# Altium project MB1137.PrjPCB (part 1 of 2)
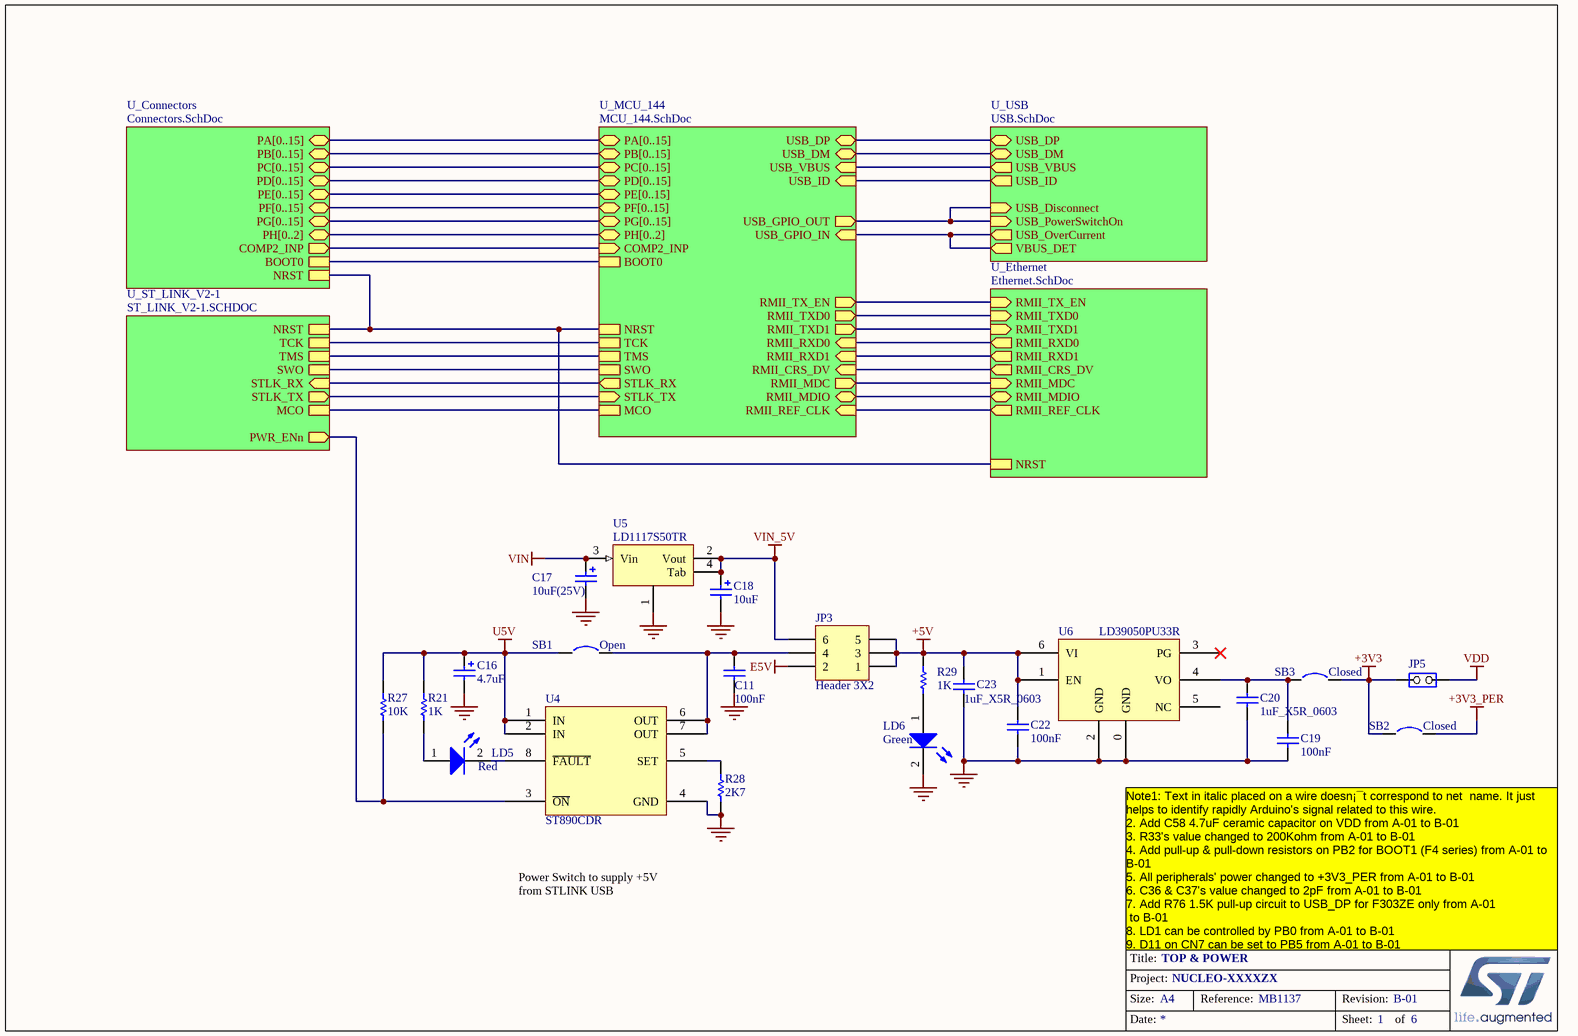
[diagram p0: MB1137.SchDoc]
6 sheets, 293 parts. Net scope: hierarchical (ports join the sheet entries above them; power ports are global).
Board file: MB1137.PcbDoc
Sheets:
  MB1137.SchDoc
    U_Connectors = Connectors.SchDoc
    U_ST_LINK_V2-1 = ST_LINK_V2-1.SCHDOC
    U_Ethernet = Ethernet.SchDoc
    U_MCU_144 = MCU_144.SchDoc
    U_USB = USB.SchDoc

## Sheet MB1137.SchDoc: TOP & POWER
size A4; DocumentNumber: MB1137; Revision: B-01; SheetNumber: 1; SheetTotal: 6; Project: NUCLEO-XXXXZX

### Parts
C11  100nF  [0603C]
C16  4.7uF  [TAN-A]
C17  10uF(25V)  [TAN-B]
C18  10uF  [TAN-A]
C19  100nF  [0603C]
C20  1uF_X5R_0603  [0603C]
C22  100nF  [0603C]
C23  1uF_X5R_0603  [0603C]
JP3  Header 3X2  [HDR_3x2_2R54_V_M]
JP5  (no value)  [HDR_1x2_2R54_V_M_S]
LD5  Red  [0603D-R]
LD6  Green  [0603D-G]
R21  1K  [0603R]
R27  10K  [0603R]
R28  2K7  [0603R]
R29  1K  [0603R]
SB1  Open  [SB_0603]
SB2  Closed  [SB_0603]
SB3  Closed  [SB_0603]
U4  ST890CDR  [SOIC8_1R27_4R9X6]
U5  LD1117S50TR  [SOT-223]
U6  LD39050PU33R  [DFN6_0R95_3x3_TP]

### Sub-sheets
U_Connectors = Connectors.SchDoc: PA[0..15] (bidir), PB[0..15] (bidir), PC[0..15] (bidir), NRST, BOOT0, PD[0..15] (bidir), PE[0..15] (bidir), PF[0..15] (bidir), PG[0..15] (bidir), PH[0..2] (bidir), COMP2_INP (out)
U_Ethernet = Ethernet.SchDoc: RMII_TXD0 (in), RMII_TX_EN (in), RMII_RXD0 (out), RMII_REF_CLK (out), RMII_CRS_DV (out), RMII_MDC (in), RMII_MDIO (bidir), NRST, RMII_TXD1 (in), RMII_RXD1 (out)
U_MCU_144 = MCU_144.SchDoc: NRST, MCO, STLK_TX (in), STLK_RX (out), PA[0..15] (bidir), PB[0..15] (bidir), PC[0..15] (bidir), TCK, TMS, SWO, BOOT0, PD[0..15] (bidir), PE[0..15] (bidir), PF[0..15] (bidir), PG[0..15] (bidir), PH[0..2] (bidir), USB_DM (bidir), USB_DP (bidir), USB_GPIO_OUT (out), USB_GPIO_IN (in), USB_ID (in), USB_VBUS (in), RMII_TXD0 (out), RMII_TX_EN (out), RMII_RXD0 (in), RMII_REF_CLK (in), RMII_CRS_DV (in), RMII_MDC (out), RMII_MDIO (bidir), RMII_TXD1 (out), RMII_RXD1 (in), COMP2_INP (in)
U_ST_LINK_V2-1 = ST_LINK_V2-1.SCHDOC: TMS, TCK, MCO, NRST, STLK_RX (in), STLK_TX (out), SWO, PWR_ENn (out)
U_USB = USB.SchDoc: USB_PowerSwitchOn (in), USB_OverCurrent (out), USB_DM (bidir), USB_DP (bidir), USB_ID (out), USB_VBUS (out), USB_Disconnect (in), VBUS_DET (out)

### Nets
+3V3: JP5.1(COMMON) SB2.1 SB3.2
+3V3_PER: SB2.2
+5V: C22.2 C23.1 JP3.1 JP3.3 JP3.5 R29.2 U6.1(EN) U6.6(VI)
E5V: JP3.2
GND: C11.1 C16.2 C17.2 C18.2 C19.1 C20.2 C22.1 C23.2 LD6.2(K) R28.1 U4.4(GND) U5.1 U6.0(GND) U6.2(GND)
U5V: C16.1 R21.1 R27.1 SB1.1 U4.1(IN) U4.2(IN)
VDD: JP5.2(NO)
VIN: C17.1 U5.3(Vin)
VIN_5V: C18.1 JP3.6 U5.2(Vout) U5.4(Tab)
BOOT0: sheet U_Connectors/BOOT0, sheet U_MCU_144/BOOT0
MCO: sheet U_ST_LINK_V2-1/MCO, sheet U_MCU_144/MCO
NRST: sheet U_Connectors/NRST, sheet U_ST_LINK_V2-1/NRST, sheet U_Ethernet/NRST, sheet U_MCU_144/NRST
PA13: sheet U_ST_LINK_V2-1/TMS, sheet U_MCU_144/TMS
PA14: sheet U_ST_LINK_V2-1/TCK, sheet U_MCU_144/TCK
PB3: sheet U_ST_LINK_V2-1/SWO, sheet U_MCU_144/SWO
PG6: sheet U_MCU_144/USB_GPIO_OUT, sheet U_USB/USB_PowerSwitchOn, sheet U_USB/USB_Disconnect
NetC11_2: C11.2 JP3.4 SB1.2 U4.6(OUT) U4.7(OUT)
NetC19_2: C19.2 C20.1 SB3.1 U6.4(VO)
NetC54_1: sheet U_MCU_144/USB_VBUS, sheet U_USB/USB_VBUS
NetCN5_1: sheet U_ST_LINK_V2-1/STLK_RX, sheet U_MCU_144/STLK_RX
NetCN5_2: sheet U_ST_LINK_V2-1/STLK_TX, sheet U_MCU_144/STLK_TX
NetCN9_15: sheet U_Connectors/COMP2_INP, sheet U_Ethernet/RMII_CRS_DV, sheet U_MCU_144/RMII_CRS_DV, sheet U_MCU_144/COMP2_INP
NetCN13_2: sheet U_MCU_144/USB_DM, sheet U_USB/USB_DM
NetCN13_3: sheet U_MCU_144/USB_DP, sheet U_USB/USB_DP
NetCN13_4: sheet U_MCU_144/USB_ID, sheet U_USB/USB_ID
NetJP4_1: sheet U_MCU_144/USB_GPIO_IN, sheet U_USB/USB_OverCurrent, sheet U_USB/VBUS_DET
NetJP7_1: sheet U_Ethernet/RMII_TXD1, sheet U_MCU_144/RMII_TXD1
NetLD5_1: LD5.1(A) R21.2
NetLD5_2: LD5.2(K) U4.8(~{FAULT})
NetLD6_1: LD6.1(A) R29.1
NetR27_2: R27.2 U4.3(~{ON}) ; sheet U_ST_LINK_V2-1/PWR_ENn
NetR28_2: R28.2 U4.5(SET)
NetR42_2: sheet U_Ethernet/RMII_RXD0, sheet U_MCU_144/RMII_RXD0
NetR45_2: sheet U_Ethernet/RMII_RXD1, sheet U_MCU_144/RMII_RXD1
NetR46_1: sheet U_Ethernet/RMII_MDIO, sheet U_MCU_144/RMII_MDIO
NetR48_2: sheet U_Ethernet/RMII_REF_CLK, sheet U_MCU_144/RMII_REF_CLK
NetSB164_1: sheet U_Ethernet/RMII_MDC, sheet U_MCU_144/RMII_MDC
NetSB182_2: sheet U_Ethernet/RMII_TXD0, sheet U_MCU_144/RMII_TXD0
NetSB183_2: sheet U_Ethernet/RMII_TX_EN, sheet U_MCU_144/RMII_TX_EN

Not connected (* = marked no-connect by the designer): U6 3(PG)* 5(NC)

### Buses and harness runs
bus sheet U_Connectors/PA[0..15] = sheet U_MCU_144/PA[0..15]
bus sheet U_Connectors/PB[0..15] = sheet U_MCU_144/PB[0..15]
bus sheet U_Connectors/PC[0..15] = sheet U_MCU_144/PC[0..15]
bus sheet U_Connectors/PD[0..15] = sheet U_MCU_144/PD[0..15]
bus sheet U_Connectors/PE[0..15] = sheet U_MCU_144/PE[0..15]
bus sheet U_Connectors/PF[0..15] = sheet U_MCU_144/PF[0..15]
bus sheet U_Connectors/PG[0..15] = sheet U_MCU_144/PG[0..15]
bus sheet U_Connectors/PH[0..2] = sheet U_MCU_144/PH[0..2]

### Notes on the sheet
- Power Switch to supply +5V from STLINK USB
- Note1: Text in italic placed on a wire doesn¡¯t correspond to net  name. It just helps to identify rapidly Arduino's signal related to this wire.
  2. Add C58 4.7uF ceramic capacitor on VDD from A-01 to B-01
  3. R33's value changed to 200Kohm from A-01 to B-01
  4. Add pull-up & pull-down resistors on PB2 for BOOT1 (F4 series) from A-01 to B-01
  5. All peripherals' power changed to +3V3_PER from A-01 to B-01
  6. C36 & C37's value changed to 2pF from A-01 to B-01
  7. Add R76 1.5K pull-up circuit to USB_DP for F303ZE only from A-01
  to B-01
  8. LD1 can be controlled by PB0 from A-01 to B-01
  9. D11 on CN7 can be set to PB5 from A-01 to B-01
- Title:
- Project:
- Size:
- Date:
- A4
- Reference:
- Sheet:
- Revision:
- of

### Library data of the parts
C11 C19 C22 = Capacitor_ST: Capacitor 0402 / 0603 / 0805; Revision: July-2002: Re-released for DXP Platform.; Value: 100nF
C16 = Cap Pol1: Polarized Capacitor (Radial); Value: 100pF; Ordered by: Subcon; Published: 8-Jun-2000; Revision: July-2002: Re-released for DXP Platform.; Publisher: Altium Limited
C17 C18 = Cap Pol1: Polarized Capacitor (Radial); Published: 8-Jun-2000; Revision: July-2002: Re-released for DXP Platform.; Publisher: Altium Limited; Value: 10uF
C20 C23 = CAP SMD 0603  X5R 1µF 25V 10%: 0603  X5R 1µF; Rated voltage: 25V; Tolerance: 10%; Manufacturer: *; Manufacturer P/N: *; Order code Farnell: 1288202RL; Value: 1µF; Power: *; Technology: X5R; Temperature  Factor: *; Temperature Max: +125°C; Temperature Min: -55°C; STS Code: *
JP3 = Header 3X2: Header, 3-Pin, Dual row; Revision: 17-Jul-2002: Re-released for DXP Platform.; Publisher: Altium Limited
JP5 = JP2
LD5 LD6 = LED2: Typical RED, GREEN, YELLOW, AMBER GaAs LED; Published: 8-Jun-2000; Revision: July-2002: Re-released for DXP Platform.; Publisher: Altium Limited
R21 = Res1: Resistor; Ordered by: Subcon; Published: 8-Jun-2000; Revision: July-2002: Re-released for DXP Platform.; Publisher: Altium Limited; Value: 1K
R27 = Resistor_ST: Resistor 0402 / 0603 / 0805; Value: 10K
R28 R29 = Resistor_ST: Resistor 0402 / 0603 / 0805; Value: 10K
SB1 = Circuit Breaker: Published: 24-Mar-1999; Revision: July-2002: Re-released for DXP Platform.; Publisher: Altium Limited
SB2 SB3 = Circuit Breaker_close: Circuit Breaker; Published: 24-Mar-1999; Revision: July-2002: Re-released for DXP Platform.; Publisher: Altium Limited
U5 = LD1117
U6 = LD39050P

## Sheet Connectors.SchDoc: Extension connectors
size A3; DocumentNumber: MB1137; Revision: B-01; SheetNumber: 6; SheetTotal: 6; Project: NUCLEO-XXXXZX
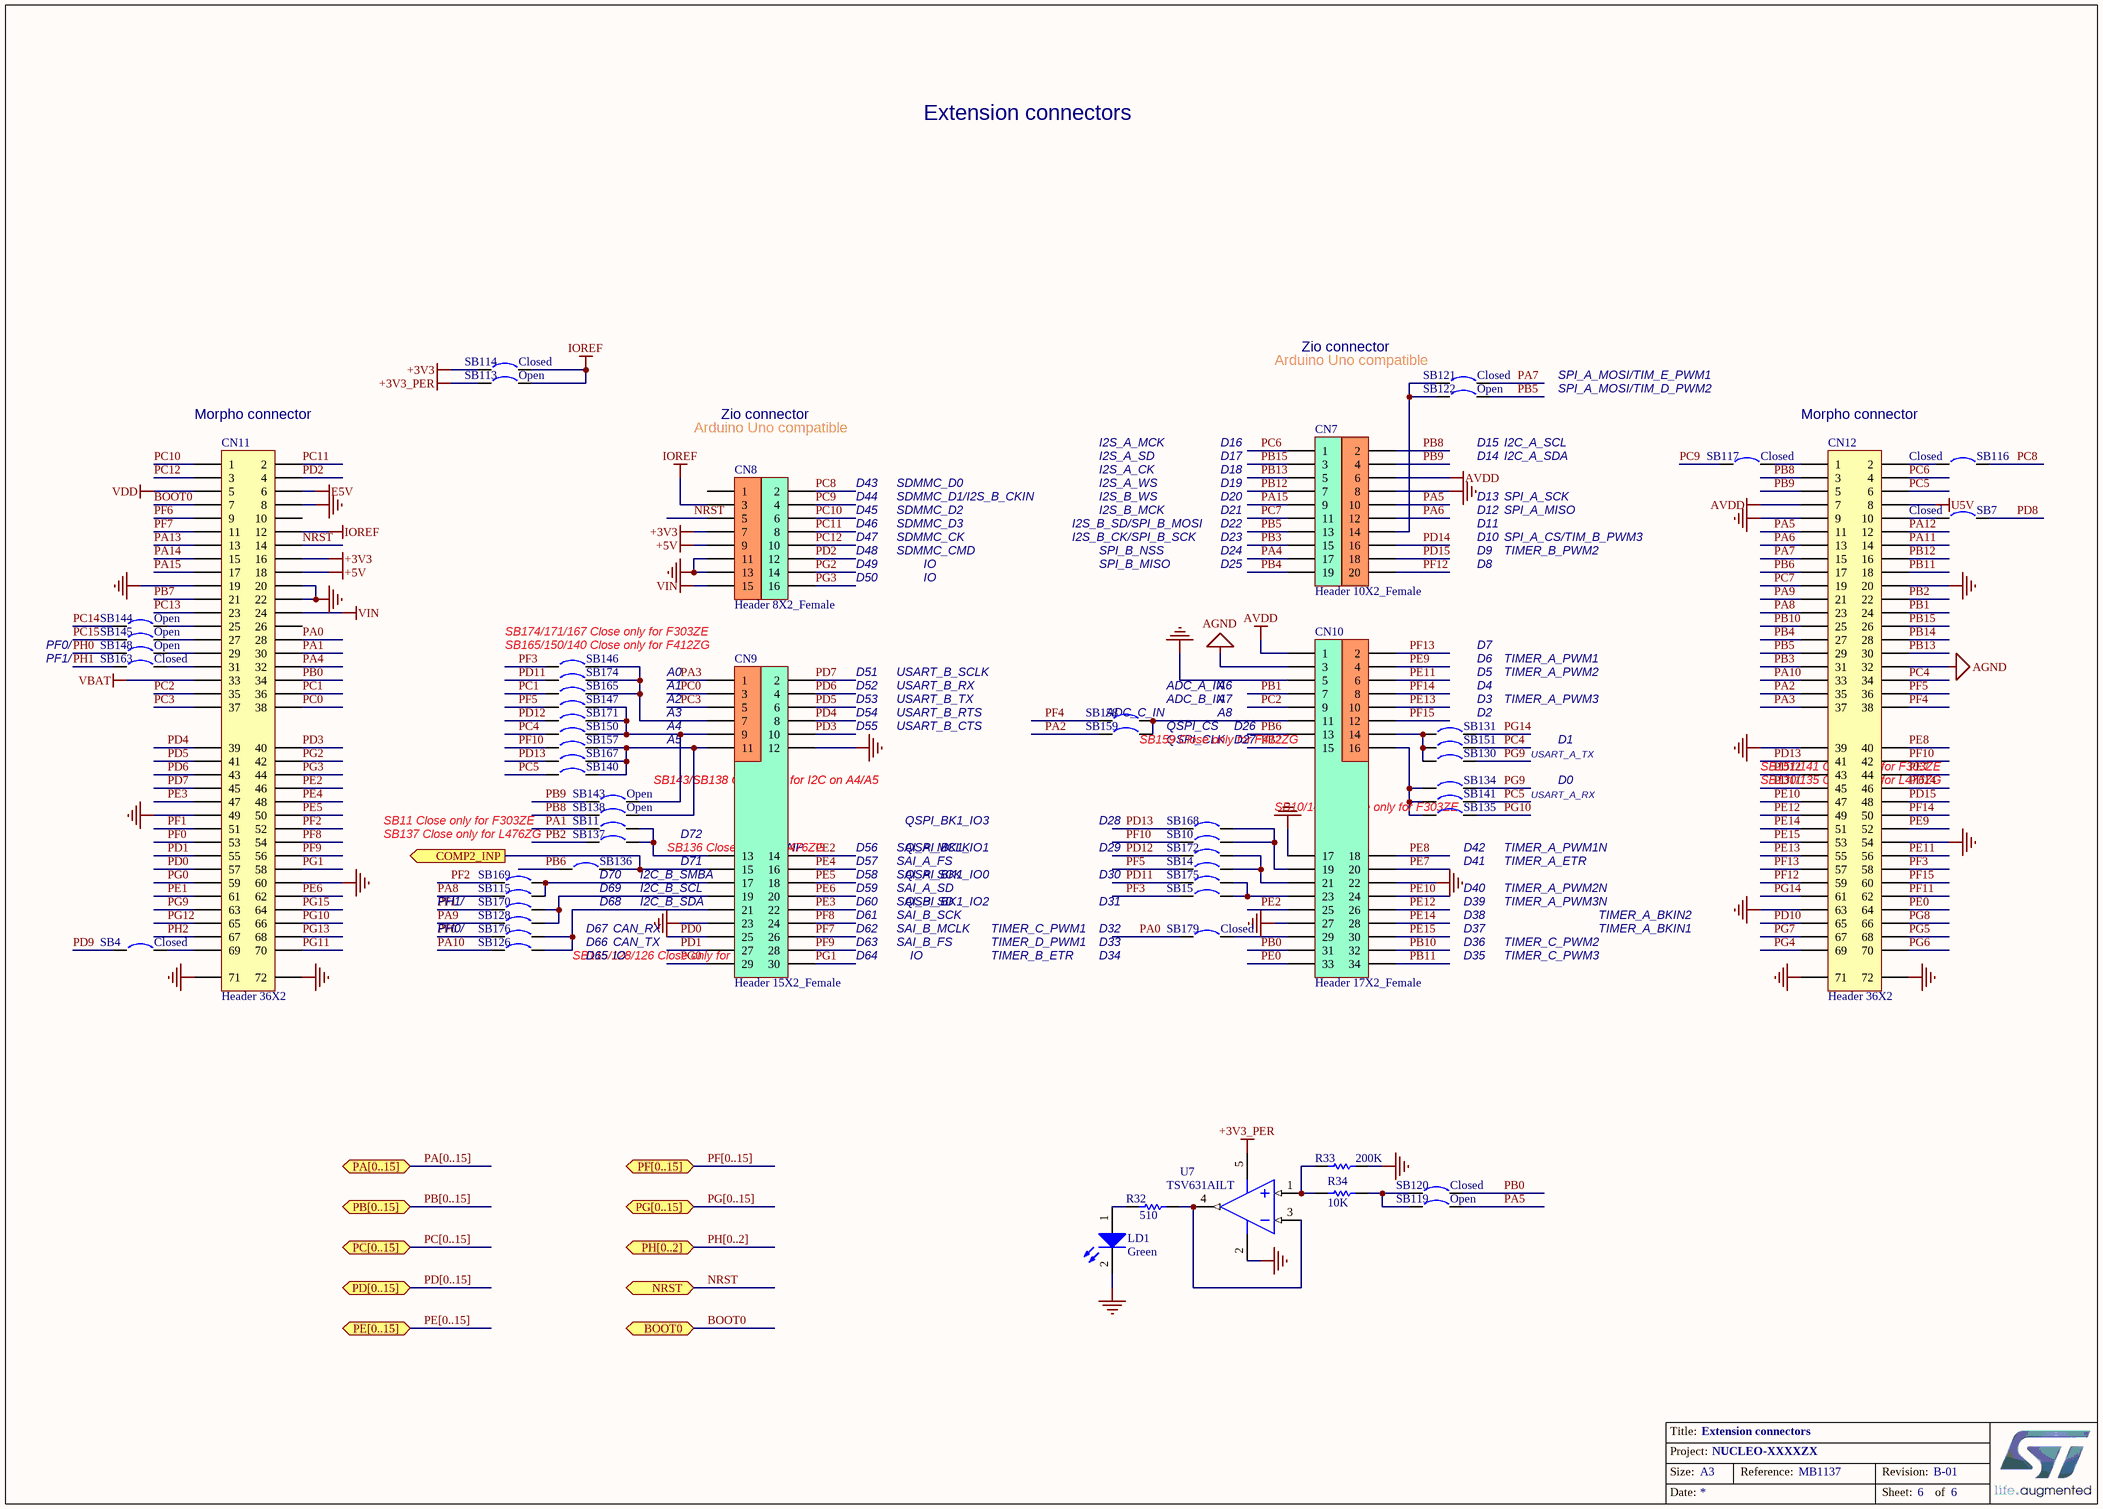
[diagram p1: Connectors.SchDoc]

### Parts
CN7  Header 10X2_Female  [HDR_10x2_2R54_V_F]
CN8  Header 8X2_Female  [HDR_8x2_2R54_V_F]
CN9  Header 15X2_Female  [HDR_15x2_2R54_V_F]
CN10  Header 17X2_Female  [HDR_17x2_2R54_V_F]
CN11  Header 36X2  [HDR_2x36_2R54_V_M]
CN12  Header 36X2  [HDR_2x36_2R54_V_M]
LD1  Green  [0603D-G]
R32  510  [0603R]
R33  200K  [0603R]
R34  10K  [0603R]
SB4  Closed  [SB_0603]
SB7  Closed  [SB_0603]
SB10  Circuit Breaker  [SB_0603]  (value not drawn)
SB11  Circuit Breaker  [SB_0603]  (value not drawn)
SB14  Circuit Breaker  [SB_0603]  (value not drawn)
SB15  Circuit Breaker  [SB_0603]  (value not drawn)
SB113  Open  [SB_0603]
SB114  Closed  [SB_0603]
SB115  Circuit Breaker  [SB_0603]  (value not drawn)
SB116  Closed  [SB_0603]
SB117  Closed  [SB_0603]
SB119  Open  [SB_0603]
SB120  Closed  [SB_0603]
SB121  Closed  [SB_0603]
SB122  Open  [SB_0603]
SB126  Circuit Breaker  [SB_0603]  (value not drawn)
SB128  Circuit Breaker  [SB_0603]  (value not drawn)
SB130  Circuit Breaker  [SB_0603]  (value not drawn)
SB131  Circuit Breaker  [SB_0603]  (value not drawn)
SB134  Circuit Breaker  [SB_0603]  (value not drawn)
SB135  Circuit Breaker  [SB_0603]  (value not drawn)
SB136  Circuit Breaker  [SB_0603]  (value not drawn)
SB137  Circuit Breaker  [SB_0603]  (value not drawn)
SB138  Open  [SB_0603]
SB140  Circuit Breaker  [SB_0603]  (value not drawn)
SB141  Circuit Breaker  [SB_0603]  (value not drawn)
SB143  Open  [SB_0603]
SB144  Open  [SB_0603]
SB145  Open  [SB_0603]
SB146  Circuit Breaker  [SB_0603]  (value not drawn)
SB147  Circuit Breaker  [SB_0603]  (value not drawn)
SB148  Open  [SB_0603]
SB150  Circuit Breaker  [SB_0603]  (value not drawn)
SB151  Circuit Breaker  [SB_0603]  (value not drawn)
SB157  Circuit Breaker  [SB_0603]  (value not drawn)
SB158  Circuit Breaker  [SB_0603]  (value not drawn)
SB159  Circuit Breaker  [SB_0603]  (value not drawn)
SB163  Closed  [SB_0603]
SB165  Circuit Breaker  [SB_0603]  (value not drawn)
SB167  Circuit Breaker  [SB_0603]  (value not drawn)
SB168  Circuit Breaker  [SB_0603]  (value not drawn)
SB169  Circuit Breaker  [SB_0603]  (value not drawn)
SB170  Circuit Breaker  [SB_0603]  (value not drawn)
SB171  Circuit Breaker  [SB_0603]  (value not drawn)
SB172  Circuit Breaker  [SB_0603]  (value not drawn)
SB174  Circuit Breaker  [SB_0603]  (value not drawn)
SB175  Circuit Breaker  [SB_0603]  (value not drawn)
SB176  Circuit Breaker  [SB_0603]  (value not drawn)
SB179  Closed  [SB_0603]
U7  TSV631AILT  [SOT-23-5L]

### Ports
BOOT0, COMP2_INP (out), NRST, PA[0..15] (bidir), PB[0..15] (bidir), PC[0..15] (bidir), PD[0..15] (bidir), PE[0..15] (bidir), PF[0..15] (bidir), PG[0..15] (bidir), PH[0..2] (bidir)

### Nets
+3V3: CN8.7 CN11.16 SB114.1
+3V3_PER: SB113.1 U7.5(VCC)
+5V: CN8.9 CN11.18
AGND: CN10.3 CN12.32
AVDD: CN7.6 CN10.1 CN12.7
E5V: CN11.6
GND: CN7.8 CN8.11 CN8.13 CN9.12 CN9.23 CN10.5 CN10.17 CN10.22 CN10.27 CN11.8 CN11.19 CN11.20 CN11.22 CN11.49 CN11.60 CN11.71 CN11.72 CN12.9 CN12.20 CN12.39 CN12.54 CN12.63 CN12.71 CN12.72 LD1.2(K) R33.2 U7.2(VDD)
IOREF: CN8.3 CN11.12 SB113.2 SB114.2
U5V: CN12.8
VBAT: CN11.33
VDD: CN11.5
VIN: CN8.15 CN11.24
BOOT0: CN11.7 ; port BOOT0
NRST: CN8.5 CN11.14 ; port NRST
PA0: CN11.28 SB179.1
PA1: CN11.30 SB11.2
PA2: CN12.35 SB159.1
PA3: CN9.1 CN12.37
PA4: CN7.17 CN11.32
PA5: CN7.10 CN12.11 SB119.2
PA6: CN7.12 CN12.13
PA7: CN12.15 SB121.2
PA8: CN12.23 SB115.2
PA9: CN12.21 SB128.2
PA10: CN12.33 SB126.2
PA11: CN12.14
PA12: CN12.12
PA13: CN11.13
PA14: CN11.15
PA15: CN7.9 CN11.17
PB0: CN10.31 CN11.34 SB120.1
PB1: CN10.7 CN12.24
PB2: CN10.15 CN12.22 SB137.2
PB3: CN7.15 CN12.31
PB4: CN7.19 CN12.27
PB5: CN7.13 CN12.29 SB122.2
PB6: CN10.13 CN12.17 SB136.2
PB7: CN11.21
PB8: CN7.2 CN12.3 SB138.2
PB9: CN7.4 CN12.5 SB143.2
PB10: CN10.32 CN12.25
PB11: CN10.34 CN12.18
PB12: CN7.7 CN12.16
PB13: CN7.5 CN12.30
PB14: CN12.28
PB15: CN7.3 CN12.26
PC0: CN9.3 CN11.38
PC1: CN11.36 SB165.2
PC2: CN10.9 CN11.35
PC3: CN9.5 CN11.37
PC4: CN12.34 SB150.2 SB151.1
PC5: CN12.6 SB140.2 SB141.1
PC6: CN7.1 CN12.4
PC7: CN7.11 CN12.19
PC8: CN8.2 SB116.1
PC9: CN8.4 SB117.1
PC10: CN8.6 CN11.1
PC11: CN8.8 CN11.2
PC12: CN8.10 CN11.3
PC13: CN11.23
PC14: SB144.1
PC15: SB145.1
PD0: CN9.25 CN11.57
PD1: CN9.27 CN11.55
PD2: CN8.12 CN11.4
PD3: CN9.10 CN11.40
PD4: CN9.8 CN11.39
PD5: CN9.6 CN11.41
PD6: CN9.4 CN11.43
PD7: CN9.2 CN11.45
PD8: SB7.2
PD9: SB4.1
PD10: CN12.65
PD11: CN12.45 SB174.2 SB175.1
PD12: CN12.43 SB171.2 SB172.1
PD13: CN12.41 SB167.2 SB168.1
PD14: CN7.16 CN12.46
PD15: CN7.18 CN12.48
PE0: CN10.33 CN12.64
PE1: CN11.61
PE2: CN9.14 CN10.25 CN11.46
PE3: CN9.22 CN11.47
PE4: CN9.16 CN11.48
PE5: CN9.18 CN11.50
PE6: CN9.20 CN11.62
PE7: CN10.20 CN12.44
PE8: CN10.18 CN12.40
PE9: CN10.4 CN12.52
PE10: CN10.24 CN12.47
PE11: CN10.6 CN12.56
PE12: CN10.26 CN12.49
PE13: CN10.10 CN12.55
PE14: CN10.28 CN12.51
PE15: CN10.30 CN12.53
PF0: CN11.53 SB176.2
PF1: CN11.51 SB170.2
PF2: CN11.52 SB169.2
PF3: CN12.58 SB15.1 SB146.2
PF4: CN12.38 SB158.1
PF5: CN12.36 SB14.1 SB147.2
PF6: CN11.9
PF7: CN9.26 CN11.11
PF8: CN9.24 CN11.54
PF9: CN9.28 CN11.56
PF10: CN12.42 SB10.1 SB157.2
PF11: CN12.62
PF12: CN7.20 CN12.59
PF13: CN10.2 CN12.57
PF14: CN10.8 CN12.50
PF15: CN10.12 CN12.60
PG0: CN9.29 CN11.59
PG1: CN9.30 CN11.58
PG2: CN8.14 CN11.42
PG3: CN8.16 CN11.44
PG4: CN12.69
PG5: CN12.68
PG6: CN12.70
PG7: CN12.67
PG8: CN12.66
PG9: CN11.63 SB130.1 SB134.1
PG10: CN11.66 SB135.1
PG11: CN11.70
PG12: CN11.65
PG13: CN11.68
PG14: CN12.61 SB131.1
PG15: CN11.64
PH0: SB148.1
PH1: SB163.1
PH2: CN11.67
NetCN7_14: CN7.14 SB121.1 SB122.1
NetCN9_7: CN9.7 SB146.1 SB165.1 SB174.1
NetCN9_9: CN9.9 SB143.1 SB147.1 SB150.1 SB171.1
NetCN9_11: CN9.11 SB138.1 SB140.1 SB157.1 SB167.1
NetCN9_13: CN9.13 SB11.1 SB137.1
NetCN9_15: CN9.15 SB136.1 ; port COMP2_INP
NetCN9_17: CN9.17 SB115.1 SB169.1
NetCN9_19: CN9.19 SB128.1 SB170.1
NetCN9_21: CN9.21 SB126.1 SB176.1
NetCN10_11: CN10.11 SB158.2 SB159.2
NetCN10_14: CN10.14 SB130.2 SB131.2 SB151.2
NetCN10_16: CN10.16 SB134.2 SB135.2 SB141.2
NetCN10_19: CN10.19 SB10.2 SB168.2
NetCN10_21: CN10.21 SB14.2 SB172.2
NetCN10_23: CN10.23 SB15.2 SB175.2
NetCN10_29: CN10.29 SB179.2
NetCN11_25: CN11.25 SB144.2
NetCN11_27: CN11.27 SB145.2
NetCN11_29: CN11.29 SB148.2
NetCN11_31: CN11.31 SB163.2
NetCN11_69: CN11.69 SB4.2
NetCN12_1: CN12.1 SB117.2
NetCN12_2: CN12.2 SB116.2
NetCN12_10: CN12.10 SB7.1
NetLD1_1: LD1.1(A) R32.2
NetR32_1: R32.1 U7.3(IN-) U7.4(OUT)
NetR33_1: R33.1 R34.1 U7.1(IN+)
NetR34_2: R34.2 SB119.1 SB120.2

Not connected (* = marked no-connect by the designer): CN8 1; CN11 10 26

### Buses and harness runs
bus PA[0..15] = port PA[0..15]
bus PB[0..15] = port PB[0..15]
bus PC[0..15] = port PC[0..15]
bus PD[0..15] = port PD[0..15]
bus PE[0..15] = port PE[0..15]
bus PF[0..15] = port PF[0..15]
bus PG[0..15] = port PG[0..15]
bus PH[0..2] = port PH[0..2]

### Notes on the sheet
- Extension connectors
- Arduino Uno compatible
- Zio connector
- SPI_A_MOSI/TIM_E_PWM1
- (near CN11) Morpho connector
- I2S_A_MCK
- D16
- D15
- I2C_A_SCL
- SPI_A_MOSI/TIM_D_PWM2
- Morpho connector
- D43
- D44
- D45
- SDMMC_D0
- SDMMC_D1/I2S_B_CKIN
- SDMMC_D2
- I2S_A_SD
- I2S_A_CK
- I2S_A_WS
- I2S_B_WS
- I2S_B_MCK
- D17
- D18
- D19
- D20
- D21
- D14
- D13
- D12
- SPI_A_SCK
- SPI_A_MISO
- I2C_A_SDA
- D46
- D47
- D48
- D49
- D50
- SDMMC_CK
- SDMMC_CMD
- SDMMC_D3
- IO
- I2S_B_SD/SPI_B_MOSI
- I2S_B_CK/SPI_B_SCK
- SPI_B_MISO
- SPI_B_NSS
- D22
- D23
- D24
- D25
- D8
- D9
- D10
- D11
- TIMER_B_PWM2
- SPI_A_CS/TIM_B_PWM3
- PF0/
- SB174/171/167 Close only for F303ZE
- (near SB146) SB165/150/140 Close only for F412ZG
- D7
- PF1/
- A0
- A1
- A2
- A3
- D51
- D52
- D53
- D54
- USART_B_TX
- USART_B_RX
- USART_B_SCLK
- USART_B_RTS
- ADC_A_IN
- ADC_B_IN
- ADC_C_IN
- A6
- A7
- A8
- (near SB131) D2
- D4
- D3
- D5
- D6
- TIMER_A_PWM1
- TIMER_A_PWM2
- TIMER_A_PWM3
- (near SB140) SB143/SB138 Close only for I2C on A4/A5
- A4
- A5
- D55
- USART_B_CTS
- (near SB159) SB159 Close only for F412ZG
- QSPI_CLK
- QSPI_CS
- D26
- D27
- USART_A_TX
- D0
- D1
- SB151/141 Close only for F303ZE
- SB130/135 Close only for L476ZG
- (near CN11) /PH1
- (near CN11) /PH0
- SB11 Close only for F303ZE
- SB137 Close only for L476ZG
- (near SB137) SB136 Close only for L476ZG
- D72
- (near CN9) COMP1_INP
- D56
- SAI_A_MCLK
- QSPI_BK1_IO1
- QSPI_BK1_IO3
- D28
- D29
- (near SB168) SB10/14/15 Close only for F303ZE
- D42
- TIMER_A_PWM1N
- USART_A_RX
- PH1/
- (near SB136) D70
- (near SB136) D69
- (near SB136) D68
- I2C_B_SCL
- I2C_B_SDA
- I2C_B_SMBA
- D71
- D57
- D58
- D59
- D60
- D61
- SAI_A_SD
- SAI_A_SCK
- SAI_A_FS
- SAI_B_SD
- SAI_B_SCK
- QSPI_BK1_IO0
- QSPI_BK1_IO2
- D30
- D31
- D38
- D39
- D40
- D41
- TIMER_A_PWM2N
- TIMER_A_PWM3N
- TIMER_A_ETR
- TIMER_A_BKIN2
- PH0/
- (near SB126) SB115/128/126 Close only for F303ZE
- D67
- D66
- D65
- CAN_TX
- CAN_RX
- D62
- D63
- D64
- SAI_B_FS
- SAI_B_MCLK
- TIMER_D_PWM1
- TIMER_B_ETR
- TIMER_C_PWM1
- D32
- D33
- D34
- D35
- D36
- D37
- TIMER_C_PWM2
- TIMER_C_PWM3
- TIMER_A_BKIN1
- Title:
- Project:
- Size:
- Date:
- Reference:
- Sheet:
- Revision:
- of

### Library data of the parts
CN7 = Header 10X2_Female: Header, 10-Pin, Dual row,female; LatestRevisionDate: 17-Jul-2002; LatestRevisionNote: Re-released for DXP Platform.; Publisher: Altium Limited
CN8 = Header 8X2_Female: Header, 8-Pin, Dual row,female; LatestRevisionDate: 17-Jul-2002; LatestRevisionNote: Re-released for DXP Platform.; Publisher: Altium Limited
CN9 = Header 15X2_Female: Header, 15-Pin, Dual row,female; Revision: 17-Jul-2002: Re-released for DXP Platform.; Publisher: Altium Limited
CN10 = Header 17X2_Female: Header, 17-Pin, Dual row,female; Revision: 17-Jul-2002: Re-released for DXP Platform.; Publisher: Altium Limited
CN11 CN12 = Header 36X2: Header, 36-Pin, Dual row; Revision: 17-Jul-2002: Re-released for DXP Platform.; Publisher: Altium Limited
LD1 = LED2: as LD5 on sheet MB1137; Published: 8-Jun-2000; Revision: July-2002: Re-released for DXP Platform.; Publisher: Altium Limited
R32 = Res1: Resistor; Value: 1K; Published: 8-Jun-2000; Revision: July-2002: Re-released for DXP Platform.; Publisher: Altium Limited
R33 R34 = res1: Resistor; Value: 1K; Published: 8-Jun-2000; Revision: July-2002: Re-released for DXP Platform.; Publisher: Altium Limited
SB4 SB7 SB114 SB116 SB117 SB120 SB121 SB163 SB179 = Circuit Breaker_close: Circuit Breaker; Published: 24-Mar-1999; Revision: July-2002: Re-released for DXP Platform.; Publisher: Altium Limited
SB10 SB11 SB14 SB15 SB115 SB126 SB128 SB130 SB131 SB134-SB137 SB140 SB141 SB146 SB147 SB150 SB151 SB157-SB159 SB165 SB167-SB172 SB174-SB176 = Circuit Breaker: Solder: NO; Published: 24-Mar-1999; Revision: July-2002: Re-released for DXP Platform.; Publisher: Altium Limited
SB113 SB119 SB122 SB138 SB143-SB145 SB148 = Circuit Breaker: Published: 24-Mar-1999; Revision: July-2002: Re-released for DXP Platform.; Publisher: Altium Limited

## Sheet ST_LINK_V2-1.SCHDOC: STLINK/V2-1
size A4; DocumentNumber: MB1137; Revision: B-01; SheetNumber: 3; SheetTotal: 6; Project: NUCLEO-XXXXZX
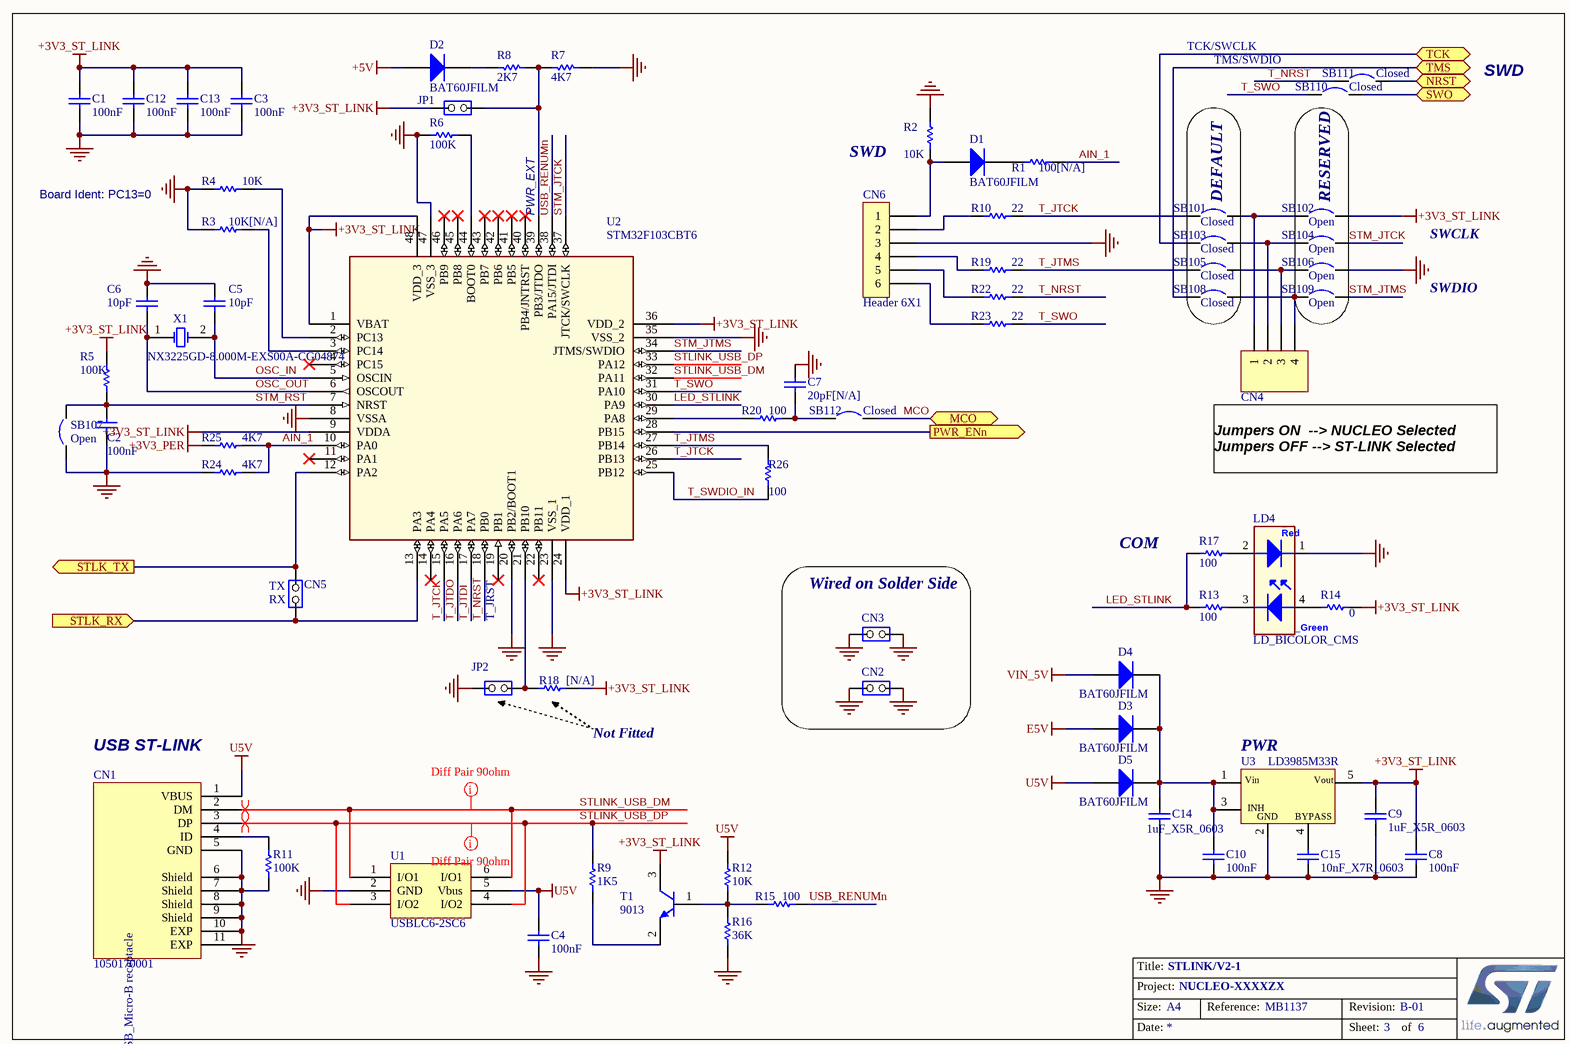
[diagram p2: ST_LINK_V2-1.SCHDOC]

### Parts
C1  100nF  [0603C]
C2  100nF  [0603C]
C3  100nF  [0603C]
C4  100nF  [0603C]
C5  10pF  [0603C]
C6  10pF  [0603C]
C7  20pF[N/A]  [0603C]
C8  100nF  [0603C]
C9  1uF_X5R_0603  [0603C]
C10  100nF  [0603C]
C12  100nF  [0603C]
C13  100nF  [0603C]
C14  1uF_X5R_0603  [0603C]
C15  10nF_X7R_0603  [0603C]
CN1  1050170001  [Molex_1050170001]
CN2  (no value)  [HDR_1x2_2R54_V_M]
CN3  (no value)  [HDR_1x2_2R54_V_M]
CN4  Header 4  [HDR_1x4_2R54_V_M]  (value not drawn)
CN5  (no value)  [HDR_1x2_2R54_V_M_S]
CN6  Header 6X1  [HDR_1x6_2R54_V_M]
D1  BAT60JFILM  [SOD-323]
D2  BAT60JFILM  [SOD-323]
D3  BAT60JFILM  [SOD-323]
D4  BAT60JFILM  [SOD-323]
D5  BAT60JFILM  [SOD-323]
JP1  (no value)  [HDR_1x2_2R54_V_M_S]
JP2  (no value)  [HDR_1x2_2R54_V_M_S]
LD4  LD_BICOLOR_CMS  [HSMF-A201]
R1  100[N/A]  [0603R]
R2  10K  [0603R]
R3  10K[N/A]  [0603R]
R4  10K  [0603R]
R5  100K  [0603R]
R6  100K  [0603R]
R7  4K7  [0603R]
R8  2K7  [0603R]
R9  1K5  [0603R]
R10  22  [0603R]
R11  100K  [0603R]
R12  10K  [0603R]
R13  100  [0603R]
R14  0  [0603R]
R15  100  [0603R]
R16  36K  [0603R]
R17  100  [0603R]
R18  [N/A]  [0603R]
R19  22  [0603R]
R20  100  [0603R]
R22  22  [0603R]
R23  22  [0603R]
R24  4K7  [0603R]
R25  4K7  [0603R]
R26  100  [0603R]
SB101  Closed  [SB_0603]
SB102  Open  [SB_0603]
SB103  Closed  [SB_0603]
SB104  Open  [SB_0603]
SB105  Closed  [SB_0603]
SB106  Open  [SB_0603]
SB107  Open  [SB_0603]
SB108  Closed  [SB_0603]
SB109  Open  [SB_0603]
SB110  Closed  [SB_0603]
SB111  Closed  [SB_0603]
SB112  Closed  [SB_0603]
T1  9013  [SOT-23]
U1  USBLC6-2SC6  [SOT23-6L]
U2  STM32F103CBT6  [LQFP48_0R5_7x7]
U3  LD3985M33R  [SOT-23-5L]
X1  NX3225GD-8.000M-EXS00A-CG04874  [OSC_2SM_3R2x2R5]

### Blocks framed on the sheet
DEFAULT: SB101 SB103 SB105 SB108
RESERVED: SB102 SB104 SB106 SB109
Wired on Solder Side: CN2 CN3

### Ports
MCO, NRST, PWR_ENn (out), STLK_RX (in), STLK_TX (out), SWO, TCK, TMS

### Nets
+3V3_PER: R25.1
+3V3_ST_LINK: C1.2 C3.2 C8.2 C9.1 C12.2 C13.2 JP1.1(COMMON) R5.2 R14.2 R18.1 SB102.2 T1.3(C) U2.1(VBAT) U2.9(VDDA) U2.24(VDD_1) U2.36(VDD_2) U2.48(VDD_3) U3.5(Vout)
+5V: D2.1(A)
E5V: D3.1(A)
GND: C1.1 C2.1 C3.1 C4.1 C5.2 C6.2 C7.2 C8.1 C9.2 C10.1 C12.1 C13.1 C14.1 C15.1 CN1.5(GND) CN1.6(Shield) CN1.7(Shield) CN1.8(Shield) CN1.9(Shield) CN1.10(EXP) CN2.1(COMMON) CN2.2(NO) CN3.1(COMMON) CN3.2(NO) CN6.3 JP2.1(COMMON) LD4.1 R2.2 R3.1 R4.1 R6.1 R7.2 R11.2 R16.1 R24.1 SB106.2 SB107.1 U1.2(GND) U2.8(VSSA) U2.20(PB2/BOOT1) U2.23(VSS_1) U2.35(VSS_2) U2.47(VSS_3) U3.2(GND)
U5V: C4.2 CN1.1(VBUS) D5.1(A) R12.2 U1.5(Vbus)
VIN_5V: D4.1(A)
AIN_1: R1.2 R24.2 R25.2 U2.10(PA0)
LED_STLINK: R13.1 R17.1 U2.30(PA9)
MCO: SB112.2 ; port MCO
NRST: SB111.2 ; port NRST
OSC_IN: C5.1 U2.5(OSCIN) X1.2(OSC2)
OSC_OUT: C6.1 U2.6(OSCOUT) X1.1(OSC1)
PA13: SB108.1 ; port TMS
PA14: SB103.1 ; port TCK
PB3: SB110.2 ; port SWO
STLINK_USB_DM: CN1.2(DM) U1.1(I/O1) U1.6(I/O1) U2.32(PA11)
STLINK_USB_DP: CN1.3(DP) R9.1 U1.3(I/O2) U1.4(I/O2) U2.33(PA12)
STM_JTCK: SB104.2 U2.37(JTCK/SWCLK)
STM_JTMS: SB109.2 U2.34(JTMS/SWDIO)
STM_RST: C2.2 R5.1 SB107.2 U2.7(NRST)
T_JTCK: R10.2 SB101.1 U2.15(PA5) U2.26(PB13)
T_JTDI: U2.17(PA7)
T_JTDO: U2.16(PA6)
T_JTMS: R19.2 R26.2 SB105.1 U2.27(PB14)
T_NRST: R22.2 SB111.1 U2.18(PB0)
T_SWDIO_IN: R26.1 U2.25(PB12)
T_SWO: R23.2 SB110.1 U2.31(PA10)
USB_RENUMn: R15.2 U2.38(PA15/JTDI)
NetC7_1: C7.1 R20.2 SB112.1
NetC10_2: C10.2 C14.2 D3.2(K) D4.2(K) D5.2(K) U3.1(Vin) U3.3(CE)
NetC15_2: C15.2 U3.4(BYPASS)
NetCN1_4: CN1.4(ID) R11.1
NetCN4_1: CN4.1 SB101.2 SB102.1
NetCN4_2: CN4.2 SB103.2 SB104.1
NetCN4_3: CN4.3 SB105.2 SB106.1
NetCN4_4: CN4.4 SB108.2 SB109.1
NetCN5_1: CN5.1(COMMON) U2.13(PA3) ; port STLK_RX
NetCN5_2: CN5.2(NO) U2.12(PA2) ; port STLK_TX
NetCN6_1: CN6.1 D1.1(A) R2.1
NetCN6_2: CN6.2 R10.1
NetCN6_4: CN6.4 R19.1
NetCN6_5: CN6.5 R22.1
NetCN6_6: CN6.6 R23.1
NetD1_2: D1.2(K) R1.1
NetD2_2: D2.2(K) R8.1
NetJP1_2: JP1.2(NO) R7.1 R8.2 U2.39(PB3/JTDO)
NetJP2_2: JP2.2(NO) R18.2 U2.21(PB10)
NetLD4_2: LD4.2 R17.2
NetLD4_3: LD4.3 R13.2
NetLD4_4: LD4.4 R14.1
NetR3_2: R3.2 U2.3(PC14)
NetR4_2: R4.2 U2.2(PC13)
NetR6_2: R6.2 U2.44(BOOT0)
NetR9_2: R9.2 T1.2(E)
NetR12_1: R12.1 R15.1 R16.2 T1.1(B)
NetR20_1: R20.1 U2.29(PA8)
NetR27_2: U2.28(PB15) ; port PWR_ENn

Not connected (* = marked no-connect by the designer): CN1 11(EXP); U2 4(PC15)* 11(PA1)* 14(PA4)* 19(PB1)* 22(PB11)* 40(PB4/JNTRST)* 41(PB5)* 42(PB6)* 43(PB7)* 45(PB8)* 46(PB9)*

### Layout directives
differential pair: (no net found under the mark)
mark named Diff Pair 90ohm: STLINK_USB_DM, STLINK_USB_DP

### Notes on the sheet
- TCK/SWCLK
- TMS/SWDIO
- SWD
- Board Ident: PC13=0
- (near U2) PWR_EXT
- SWCLK
- SWDIO
- Jumpers ON  --> NUCLEO Selected
  Jumpers OFF --> ST-LINK Selected
- (near CN5) TX
- COM
- (near CN5) RX
- T_JRST
- (near CN1) USB ST-LINK
- (near R18) Not Fitted
- (near U3) PWR
- Title:
- Project:
- Size:
- Date:
- A4
- Reference:
- Sheet:
- Revision:
- of
- (in symbol 1050170001) USB_Micro-B receptacle
- (in symbol LD3985M33R) INH
- (in symbol LD_BICOLOR_CMS) Red; _Green

### Library data of the parts
C1-C4 C8 C10 C12 C13 = Capacitor_ST: Capacitor 0402 / 0603 / 0805; Revision: July-2002: Re-released for DXP Platform.; Value: 100nF
C5-C7 = Capacitor_ST: Capacitor 0402 / 0603 / 0805; Value: 100nF; Revision: July-2002: Re-released for DXP Platform.
C9 C14 = CAP SMD 0603  X5R 1µF 25V 10%: as C20 on sheet MB1137; Manufacturer: *; Manufacturer P/N: *; Order code Farnell: 1288202RL; Value: 1µF; Power: *; Technology: X5R; Temperature  Factor: *; Temperature Max: +125°C; Temperature Min: -55°C; STS Code: *
C15 = CAP SMD 0603  X7R 10000PF 50V 10%: 0603  X7R 10NF; Order code RS: 2040779; Rated voltage: 50V; Tolerance: 10%; Order code Farnell: 7569548RL; Value: 10NF; Power: *; Technology: X7R; Temperature Factor: *; Temperature Min: -55°C; Temperature Max: +125°C; STS Code: *
CN1 = 1050170001: Silkscreen: USB
CN2 CN3 JP1 JP2 = JP2
CN4 = Header 4: Header, 4-Pin, Single row; Revision: 17-Jul-2002: Re-released for DXP Platform.; Publisher: Altium Limited
CN5 = JP2: Fitted: NO
CN6 = Header 6X1: Header, 6-Pin, Single row; LatestRevisionDate: 17-Jul-2002; LatestRevisionNote: Re-released for DXP Platform.; Publisher: Altium Limited
D1 D3-D5 = BAT60JFILM: Manuf_1: STM; Provided: ST; ECCN_US/EU: EAR99/NEC; Revision: July-2002: Re-released for DXP Platform.; Order: BAT60JFILM; Manuf_Part_1: BAT60JFILM; Distrib: ST
D2 = Diode: Default Diode; Code - JEDEC: DO-214-AB; Ordered by: STM; ECCN_US/EU: EAR99/NEC; Published: 8-Jun-2000; Revision: July-2002: Re-released for DXP Platform.; Publisher: Altium Limited
LD4 = LD_BICOLOR_CMS: Bicolor Led; Manuf_Part_1: HSMF-A201-A00J1; Manuf_1: Avago Technologies; Ref St: xxxxxx; cap_dec: ----; Distrib: RADIOSPARES
R1 R5 R6 R9-R11 R13-R15 R17 R19 R20 R22 R23 R26 = Resistor_ST: Resistor 0402 / 0603 / 0805; Value: 10K
R2 R4 = Resistor_ST: Resistor 0402 / 0603 / 0805; Value: 10K
R3 R24 R25 = Resistor_ST: Resistor 0402 / 0603 / 0805; Value: 10K; Fitted: NO
R7 R8 R12 R16 R18 = Res1: Resistor; Value: 1K; Published: 8-Jun-2000; Revision: July-2002: Re-released for DXP Platform.; Publisher: Altium Limited
SB101 SB103 SB105 SB108 SB110-SB112 = Circuit Breaker_close: Circuit Breaker; Published: 24-Mar-1999; Revision: July-2002: Re-released for DXP Platform.; Publisher: Altium Limited
SB102 SB104 SB106 SB107 SB109 = Circuit Breaker: Published: 24-Mar-1999; Revision: July-2002: Re-released for DXP Platform.; Publisher: Altium Limited
T1 = NPN: NPN Bipolar Transistor; Code - JEDEC: TO-226-AA; Published: 8-Jun-2000; Revision: July-2002: Re-released for DXP Platform.; Publisher: Altium Limited
U2 = STM32F103CBT6: Medium-density performance line ARM-based 32-bit MCU with 64KB Flash; Manuf_Part_1: STM32F103C8T6; Manuf_1: STM; Ref St: 9175981; Provided: ST; ECCN_US/EU: 3A991A2/NEC; Footprint: QFP48 7X7; Distrib: ST; Order: STM32F103C8T6
U3 = LD3985M33R: Ultra low drop-low noise BiCMOS voltage, regulators low ESR capacitors compatible; Manuf_1: STM; Provided: ST; Ref St: 9176161; ECCN_US/EU: EAR99/NEC; Manuf_Part_1: LD3985M33R; Distrib: ST; Order: LD3985M33R
X1 = XTAL: Crystal Oscillator; Published: 8-Jun-2000; LatestRevisionDate: 17-Jul-2002; LatestRevisionNote: Re-released for DXP Platform.; PackageReference: R38; Publisher: Altium Limited

## Sheet Ethernet.SchDoc: Ethernet PHY with RJ45 connector
size A4; Author: A.B; CompanyName: STMicroelectronics; Address1: 12, Rue Jules HOROWITZ; Address2: 38019 Grenoble; Address3: FRANCE; DocumentNumber: MB1137; Revision: B-01; SheetNumber: 5; SheetTotal: 6; Project: NUCLEO-XXXXZX
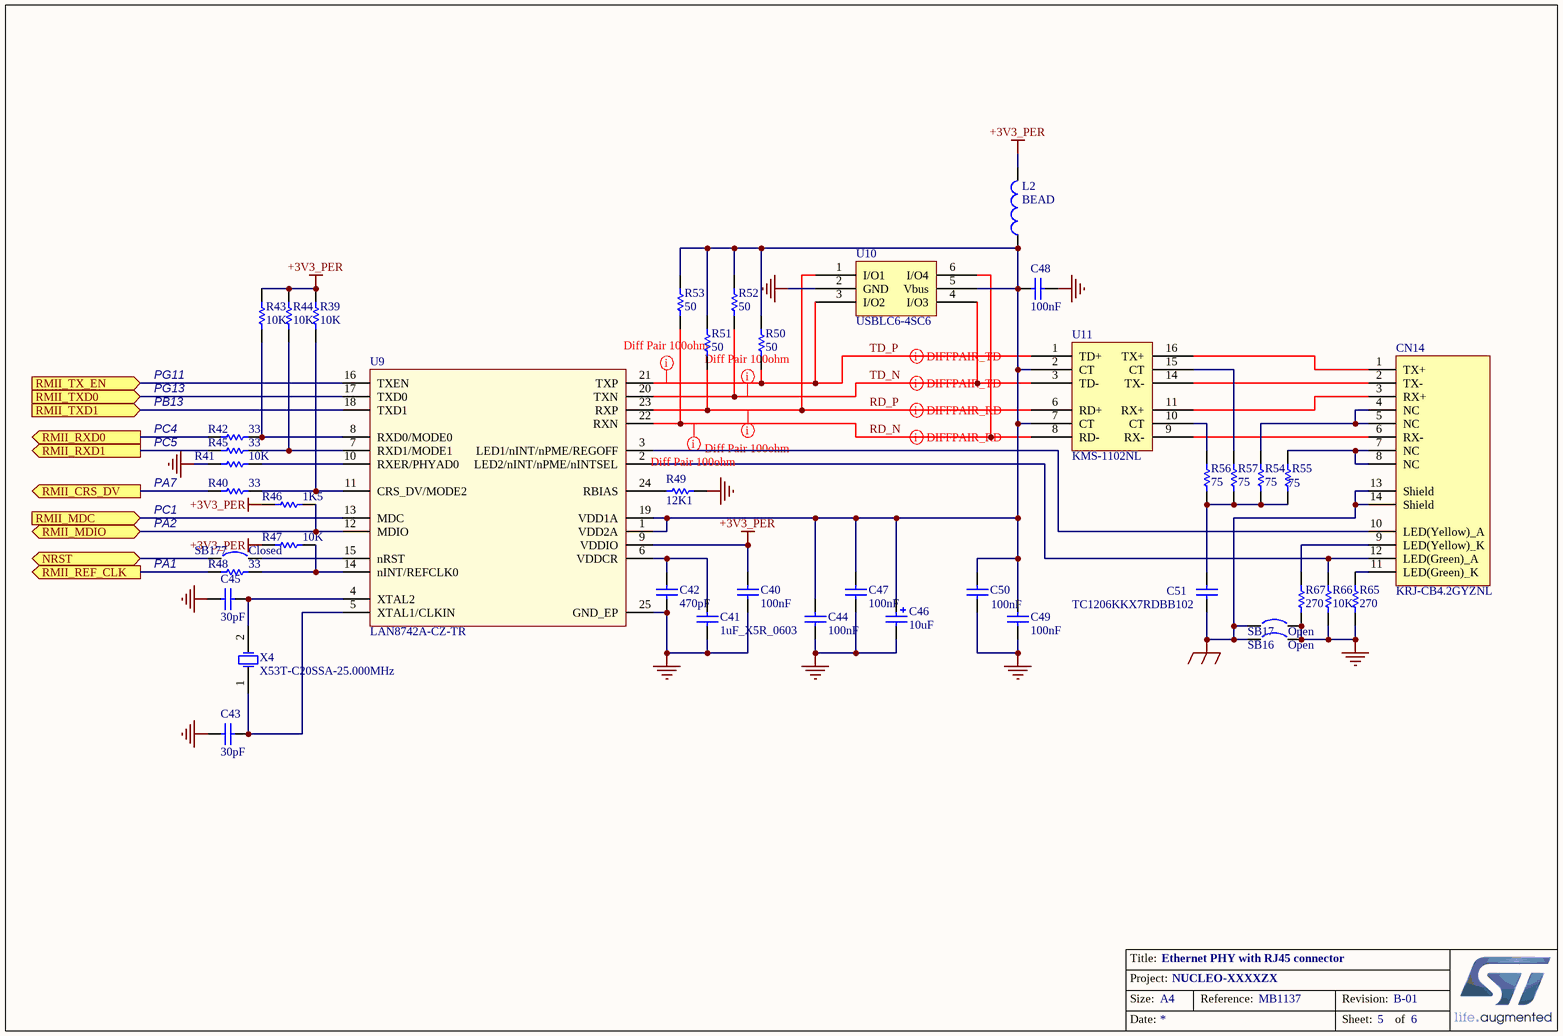
[diagram p3: Ethernet.SchDoc]

### Parts
C40  100nF  [0603C]
C41  1uF_X5R_0603  [0603C]
C42  470pF  [0603C]
C43  30pF  [0603C]
C44  100nF  [0603C]
C45  30pF  [0603C]
C46  10uF  [TAN-A]
C47  100nF  [0603C]
C48  100nF  [0603C]
C49  100nF  [0603C]
C50  100nF  [0603C]
C51  TC1206KKX7RDBB102  [1206C]
CN14  KRJ-CB4.2GYZNL  [RJ45_KRJ-CB4.2GYZNL]
L2  BEAD  [0603L]
R39  10K  [0603R]
R40  33  [0603R]
R41  10K  [0603R]
R42  33  [0603R]
R43  10K  [0603R]
R44  10K  [0603R]
R45  33  [0603R]
R46  1K5  [0603R]
R47  10K  [0603R]
R48  33  [0603R]
R49  12K1  [0603R]
R50  50  [0603R]
R51  50  [0603R]
R52  50  [0603R]
R53  50  [0603R]
R54  75  [0603R]
R55  75  [0603R]
R56  75  [0603R]
R57  75  [0603R]
R65  270  [0603R]
R66  10K  [0603R]
R67  270  [0603R]
SB16  Open  [SB_0603]
SB17  Open  [SB_0603]
SB177  Closed  [SB_0603]
U9  LAN8742A-CZ-TR  [QFN24_0R5_4X4]
U10  USBLC6-4SC6  [SOT23-6L]
U11  KMS-1102NL  [Transformer]
X4  X53T-C20SSA-25.000MHz  [XTAL_2SM_5R0X3R2]

### Ports
NRST, RMII_CRS_DV (out), RMII_MDC (in), RMII_MDIO (bidir), RMII_REF_CLK (out), RMII_RXD0 (out), RMII_RXD1 (out), RMII_TX_EN (in), RMII_TXD0 (in), RMII_TXD1 (in)

### Nets
+3V3_PER: C40.2 L2.2 R39.1 R43.1 R44.1 R46.2 R47.1 U9.9(VDDIO)
EGND: C51.1 CN14.13(Shield) CN14.14(Shield) SB16.1 SB17.1
GND: C40.1 C41.2 C42.1 C43.2 C44.1 C45.2 C46.2 C47.1 C48.1 C49.1 C50.1 R41.2 R49.2 R65.2 R66.2 R67.2 SB16.2 SB17.2 U9.25(GND_EP) U10.2(GND)
NRST: SB177.1 ; port NRST
RD_N: R53.1 U9.22(RXN) U10.6(I/O4) U11.8(RD-)
RD_P: R51.1 U9.23(RXP) U10.1(I/O1) U11.6(RD+)
TD_N: R52.1 U9.20(TXN) U10.4(I/O3) U11.3(TD-)
TD_P: R50.1 U9.21(TXP) U10.3(I/O2) U11.1(TD+)
NetC41_1: C41.1 C42.2 U9.6(VDDCR)
NetC43_1: C43.1 U9.5(XTAL1/CLKIN) X4.1(OSC1)
NetC44_2: C44.2 C46.1 C47.2 C48.2 C49.2 C50.2 L2.1 R50.2 R51.2 R52.2 R53.2 U9.1(VDD2A) U9.19(VDD1A) U10.5(Vbus) U11.2(CT) U11.7(CT)
NetC45_1: C45.1 U9.4(XTAL2) X4.2(OSC2)
NetC51_2: C51.2 R54.1 R55.1 R56.1 R57.1
NetCN9_15: R40.2 ; port RMII_CRS_DV
NetCN14_1: CN14.1(TX+) U11.16(TX+)
NetCN14_2: CN14.2(TX-) U11.14(TX-)
NetCN14_3: CN14.3(RX+) U11.11(RX+)
NetCN14_4: CN14.4(NC) CN14.5(NC) R54.2
NetCN14_6: CN14.6(RX-) U11.9(RX-)
NetCN14_7: CN14.7(NC) CN14.8(NC) R55.2
NetCN14_9: CN14.9(LED(Yellow)_K) R67.1
NetCN14_10: CN14.10(LED(Yellow)_A) U9.3(LED1/nINT/nPME/REGOFF)
NetCN14_11: CN14.11(LED(Green)_K) R65.1
NetCN14_12: CN14.12(LED(Green)_A) R66.1 U9.2(LED2/nINT/nPME/nINTSEL)
NetJP7_1: U9.18(TXD1) ; port RMII_TXD1
NetR39_2: R39.2 R40.1 U9.11(CRS_DV/MODE2)
NetR41_1: R41.1 U9.10(RXER/PHYAD0)
NetR42_1: R42.1 R43.2 U9.8(RXD0/MODE0)
NetR42_2: R42.2 ; port RMII_RXD0
NetR44_2: R44.2 R45.1 U9.7(RXD1/MODE1)
NetR45_2: R45.2 ; port RMII_RXD1
NetR46_1: R46.1 U9.12(MDIO) ; port RMII_MDIO
NetR47_2: R47.2 R48.1 U9.14(nINT/REFCLK0)
NetR48_2: R48.2 ; port RMII_REF_CLK
NetR49_1: R49.1 U9.24(RBIAS)
NetR56_2: R56.2 U11.10(CT)
NetR57_2: R57.2 U11.15(CT)
NetSB164_1: U9.13(MDC) ; port RMII_MDC
NetSB177_2: SB177.2 U9.15(nRST)
NetSB182_2: U9.17(TXD0) ; port RMII_TXD0
NetSB183_2: U9.16(TXEN) ; port RMII_TX_EN

### Layout directives
differential pair: RD_N, RD_P, TD_N, TD_P
rule Matched Net Lengths [Tolerance = 100mil]: RD_N, RD_P, TD_N, TD_P

### Notes on the sheet
- PG11
- PG13
- PB13
- PC4
- PC5
- PA7
- PC1
- PA2
- PA1
- Title:
- Project:
- Size:
- Date:
- A4
- Reference:
- Sheet:
- Revision:
- of

### Library data of the parts
C40 C44 C47-C50 = Capacitor_ST: Capacitor 0402 / 0603 / 0805; Revision: July-2002: Re-released for DXP Platform.; Value: 100nF
C41 = CAP SMD 0603  X5R 1µF 25V 10%: as C20 on sheet MB1137; Manufacturer: *; Manufacturer P/N: *; Order code Farnell: 1288202RL; Value: 1µF; Power: *; Technology: X5R; Temperature  Factor: *; Temperature Max: +125°C; Temperature Min: -55°C; STS Code: *
C42 C43 C45 = Capacitor_ST: as C5 on sheet ST_LINK_V2-1; Revision: July-2002: Re-released for DXP Platform.
C46 = Cap_10uF_POL_10%_TANA: Polarized Capacitor,10uF,10V,10%,typeA,VISHAY; Manuf_Part_1: 293D106X9010A2TE3; Revision: July-2002: Re-released for DXP Platform.; Value: 10uF; Manuf_1: VISHAY; Order: *; ECCN_US/EU: n/a
C51 = Capacitor_ST: Capacitor 0402 / 0603 / 0805/ 1206; Value: 100nF; Revision: July-2002: Re-released for DXP Platform.
CN14 = KRJ-CB4.2GYZNL: 100 Base-TX (Fast Ethernet) SMD RJ45 single port (1x1) with LEDS Integrated Magnetics Connector; Manuf_1: HanRun; Manuf_Part_1: HR961160C; Manuf_2: Pulse Electronics Corporation; Manuf_Part_2: J3011G21DNLT; Manuf_3: K.O.D International Holding; Manuf_Part_3: RMT-119A-12F6-GY-04; Distrib: Sub Co; Order: *
L2 = Inductor: Value: 100uH; Published: 8-Jun-2000; Revision: July-2002: Re-released for DXP Platform.; Publisher: Altium Limited
R39 R41 R43 R44 R47 R66 = Resistor_ST: Resistor 0402 / 0603 / 0805; Value: 10K
R40 R42 R45 R48 = Res_33_1%_0402: Resistor,33,0402,1%,YAGEO; Manuf_Part_1: RC0402FR-0733RL; Value: 33; Manuf_1: YAGEO; Order: *; ECCN_US/EU: n/a; Distrib: FARNELL
R46 = Res_1K5_1%_0402: Resistor,1K5,0402,1%,YAGEO; Manuf_Part_1: RC0402FR-071K5L; Value: 1K5; Manuf_1: YAGEO; Order: RC0402FR-071K5L; ECCN_US/EU: n/a; Distrib: FARNELL
R49 = Res_12K1_1%_0603: Resistor,12K1,0603,1%,VISHAY; Manuf_Part_1: MCT 0603-50 1% P5 12K1; Order: 2325243; Value: 12K1; ECCN_US/EU: n/a; Manuf_1: VISHAY; Distrib: FARNELL
R50-R53 = Res_50_1%_0603: Resistor,50,0603,1%,YAGEO; Manuf_Part_1: RC0402FR-0750RL; Value: 50; Manuf_1: YAGEO; Order: *; ECCN_US/EU: n/a; Distrib: FARNELL
R54-R57 = Res_75_1%_0603: Resistor,75,0603,1%,YAGEO; Manuf_Part_1: RC0402FR-0750RL; Value: 50; Manuf_1: YAGEO; Order: *; ECCN_US/EU: n/a; Distrib: FARNELL
R65 R67 = Resistor_ST: Resistor 0402 / 0603 / 0805; Value: 10K
SB16 SB17 = Circuit Breaker: Published: 24-Mar-1999; Revision: July-2002: Re-released for DXP Platform.; Publisher: Altium Limited
SB177 = Circuit Breaker_close: Circuit Breaker; Published: 24-Mar-1999; Revision: July-2002: Re-released for DXP Platform.; Publisher: Altium Limited
U9 = LAN8742A-CZ-TR: LAN8742A-CZ-TR - Small Footprint RMII 10/100 Ethernet, Transceiver with HP Auto-MDIX and flexPWR Technology SQFN-24; Manuf_1: MICROCHIP; Order: LAN8742A-CZ-TR; Manuf_Part_1: LAN8742A-CZ-TR; Distrib: MICROCHIP
X4 = XTAL_5032: Crystal Oscillator; Published: 8-Jun-2000; LatestRevisionDate: 17-Jul-2002; LatestRevisionNote: Re-released for DXP Platform.; PackageReference: R38; Publisher: Altium Limited

## Sheet MCU_144.SchDoc: MCU
size A3; DocumentNumber: MB1137; Revision: B-01; SheetNumber: 2; SheetTotal: 6; Project: NUCLEO-XXXXZX
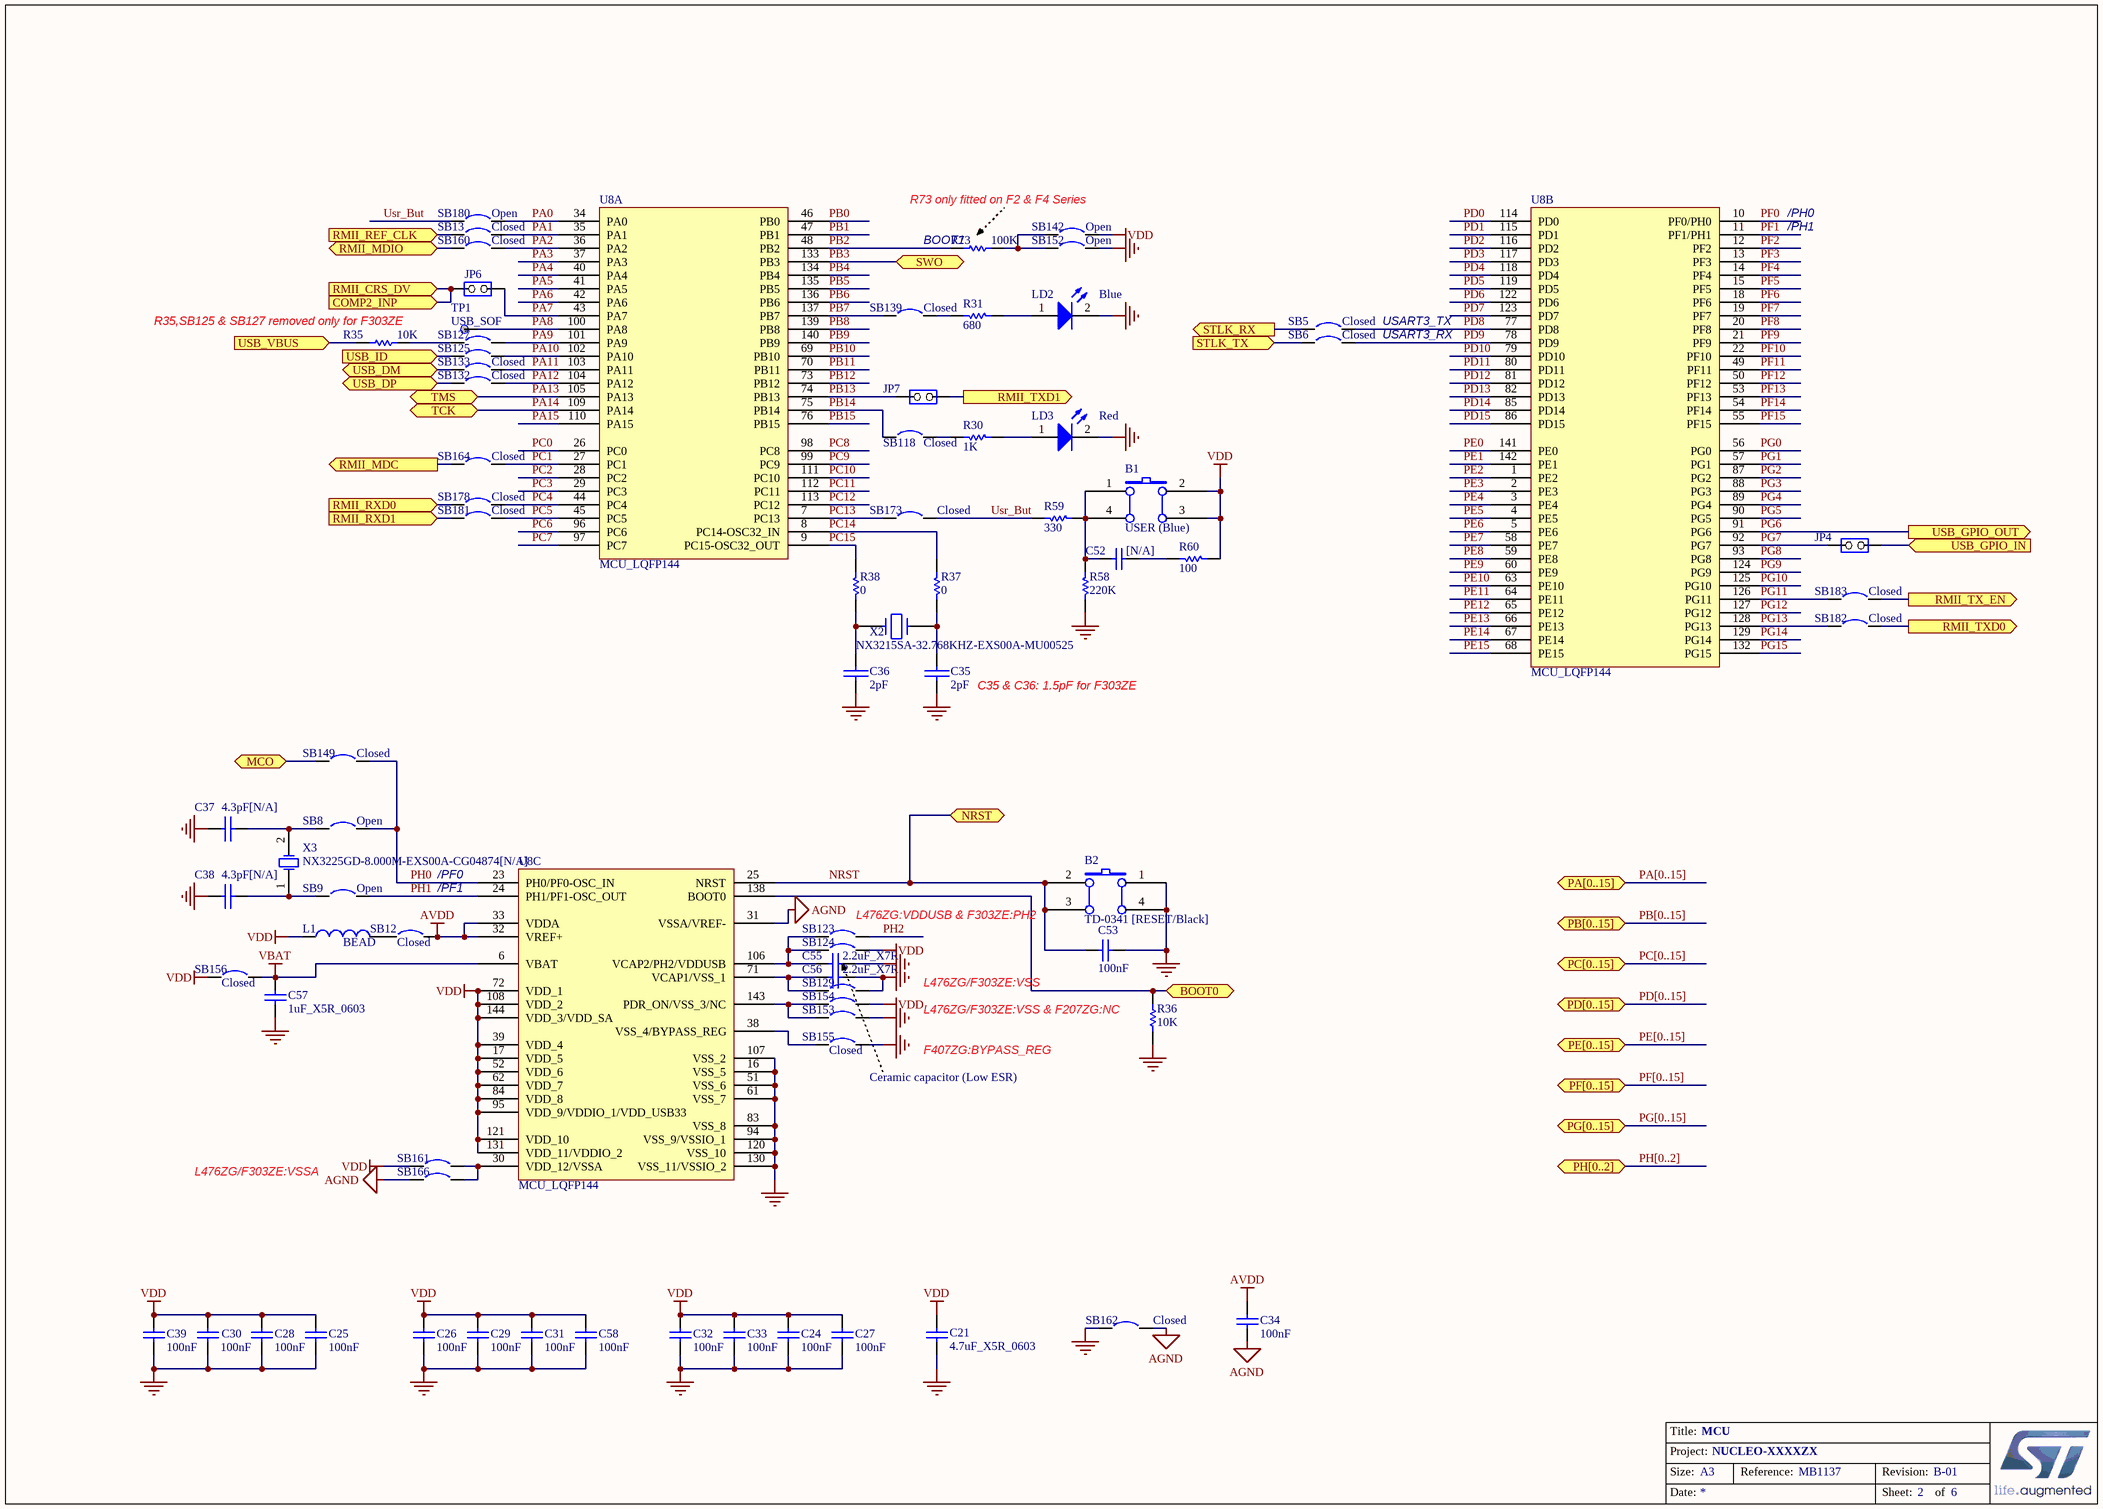
[diagram p4: MCU_144.SchDoc]

### Parts
B1  USER (Blue)  [PB-6X6mm-Blue]
B2  TD-0341 [RESET/Black]  [PB-6X6mm-Black]
C21  4.7uF_X5R_0603  [0603C]
C24  100nF  [0603C]
C25  100nF  [0603C]
C26  100nF  [0603C]
C27  100nF  [0603C]
C28  100nF  [0603C]
C29  100nF  [0603C]
C30  100nF  [0603C]
C31  100nF  [0603C]
C32  100nF  [0603C]
C33  100nF  [0603C]
C34  100nF  [0603C]
C35  2pF  [0603C]
C36  2pF  [0603C]
C37  4.3pF[N/A]  [0603C]
C38  4.3pF[N/A]  [0603C]
C39  100nF  [0603C]
C52  [N/A]  [0603C]
C53  100nF  [0603C]
C55  2.2uF_X7R  [TAN-A]
C56  2.2uF_X7R  [TAN-A]
C57  1uF_X5R_0603  [0603C]
C58  100nF  [0603C]
JP4  (no value)  [HDR_1x2_2R54_V_M_S]
JP6  (no value)  [HDR_1x2_2R54_V_M_S]
JP7  (no value)  [HDR_1x2_2R54_V_M_S]
L1  BEAD  [0603L]
LD2  Blue  [0603D-B]
LD3  Red  [0603D-R]
R30  1K  [0603R]
R31  680  [0603R]
R35  10K  [0603R]
R36  10K  [0603R]
R37  0  [0603R]
R38  0  [0603R]
R58  220K  [0603R]
R59  330  [0603R]
R60  100  [0603R]
R73  100K  [0603R]
SB5  Closed  [SB_0603]
SB6  Closed  [SB_0603]
SB8  Open  [SB_0603]
SB9  Open  [SB_0603]
SB12  Closed  [SB_0603]
SB13  Closed  [SB_0603]
SB118  Closed  [SB_0603]
SB123  Circuit Breaker  [SB_0603]  (value not drawn)
SB124  Circuit Breaker  [SB_0603]  (value not drawn)
SB125  Circuit Breaker  [SB_0603]  (value not drawn)
SB127  Circuit Breaker  [SB_0603]  (value not drawn)
SB129  Circuit Breaker  [SB_0603]  (value not drawn)
SB132  Closed  [SB_0603]
SB133  Closed  [SB_0603]
SB139  Closed  [SB_0603]
SB142  Open  [SB_0603]
SB149  Closed  [SB_0603]
SB152  Open  [SB_0603]
SB153  Circuit Breaker  [SB_0603]  (value not drawn)
SB154  Circuit Breaker  [SB_0603]  (value not drawn)
SB155  Closed  [SB_0603]
SB156  Closed  [SB_0603]
SB160  Closed  [SB_0603]
SB161  Circuit Breaker  [SB_0603]  (value not drawn)
SB162  Closed  [SB_0603]
SB164  Closed  [SB_0603]
SB166  Circuit Breaker  [SB_0603]  (value not drawn)
SB173  Closed  [SB_0603]
SB178  Closed  [SB_0603]
SB180  Open  [SB_0603]
SB181  Closed  [SB_0603]
SB182  Closed  [SB_0603]
SB183  Closed  [SB_0603]
TP1  USB_SOF  [TP]
U8  MCU_LQFP144  [LQFP144_0R5_SKT]  (parts A,B,C of 3)
X2  NX3215SA-32.768KHZ-EXS00A-MU00525  [XTAL_2SM_3R2X1R5]
X3  NX3225GD-8.000M-EXS00A-CG04874[N/A]  [OSC_2SM_3R2x2R5]

### Ports
BOOT0, COMP2_INP (in), MCO, NRST, PA[0..15] (bidir), PB[0..15] (bidir), PC[0..15] (bidir), PD[0..15] (bidir), PE[0..15] (bidir), PF[0..15] (bidir), PG[0..15] (bidir), PH[0..2] (bidir), RMII_CRS_DV (in), RMII_MDC (out), RMII_MDIO (bidir), RMII_REF_CLK (in), RMII_RXD0 (in), RMII_RXD1 (in), RMII_TX_EN (out), RMII_TXD0 (out), RMII_TXD1 (out), STLK_RX (out), STLK_TX (in), SWO, TCK, TMS, USB_DM (bidir), USB_DP (bidir), USB_GPIO_IN (in), USB_GPIO_OUT (out), USB_ID (in), USB_VBUS (in)

### Nets
AGND: C34.2 SB162.2 SB166.1 U8.31(VSSA/VREF-)
AVDD: C34.1 SB12.2 U8.32(VREF+) U8.33(VDDA)
GND: B2.1(A0) B2.4(A1) C21.2 C24.2 C25.2 C26.2 C27.2 C28.2 C29.2 C30.2 C31.2 C32.2 C33.2 C35.2 C36.2 C37.2 C38.2 C39.2 C53.1 C55.2 C56.2 C57.2 C58.2 LD2.2(K) LD3.2(K) R36.2 R58.2 SB129.2 SB152.2 SB153.2 SB155.2 SB162.1 U8.16(VSS_5) U8.51(VSS_6) U8.61(VSS_7) U8.83(VSS_8) U8.94(VSS_9/VSSIO_1) U8.107(VSS_2) U8.120(VSS_10) U8.130(VSS_11/VSSIO_2)
VBAT: C57.1 SB156.2 U8.6(VBAT)
VDD: B1.2(B0) B1.3(B1) C21.1 C24.1 C25.1 C26.1 C27.1 C28.1 C29.1 C30.1 C31.1 C32.1 C33.1 C39.1 C58.1 L1.1 R60.1 SB124.2 SB142.2 SB154.2 SB156.1 SB161.1 U8.17(VDD_5) U8.39(VDD_4) U8.52(VDD_6) U8.62(VDD_7) U8.72(VDD_1) U8.84(VDD_8) U8.95(VDD_9/VDDIO_1/VDD_USB33) U8.108(VDD_2) U8.121(VDD_10) U8.131(VDD_11/VDDIO_2) U8.144(VDD_3/VDD_SA)
BOOT0: R36.1 U8.138(BOOT0) ; port BOOT0
MCO: SB149.1 ; port MCO
NRST: B2.2(B0) B2.3(B1) C53.2 U8.25(NRST) ; port NRST
PA0: SB180.2 U8.34(PA0)
PA1: SB13.2 U8.35(PA1)
PA2: SB160.2 U8.36(PA2)
PA3: U8.37(PA3)
PA4: U8.40(PA4)
PA5: U8.41(PA5)
PA6: U8.42(PA6)
PA7: JP6.1(COMMON) U8.43(PA7)
PA8: TP1.1 U8.100(PA8)
PA9: SB127.2 U8.101(PA9)
PA10: SB125.2 U8.102(PA10)
PA11: SB133.2 U8.103(PA11)
PA12: SB132.2 U8.104(PA12)
PA13: U8.105(PA13) ; port TMS
PA14: U8.109(PA14) ; port TCK
PA15: U8.110(PA15)
PB0: U8.46(PB0)
PB1: U8.47(PB1)
PB2: R73.1 U8.48(PB2)
PB3: U8.133(PB3) ; port SWO
PB4: U8.134(PB4)
PB5: U8.135(PB5)
PB6: U8.136(PB6)
PB7: SB139.1 U8.137(PB7)
PB8: U8.139(PB8)
PB9: U8.140(PB9)
PB10: U8.69(PB10)
PB11: U8.70(PB11)
PB12: U8.73(PB12)
PB13: JP7.2(NO) U8.74(PB13)
PB14: SB118.1 U8.75(PB14)
PB15: U8.76(PB15)
PC0: U8.26(PC0)
PC1: SB164.2 U8.27(PC1)
PC2: U8.28(PC2)
PC3: U8.29(PC3)
PC4: SB178.2 U8.44(PC4)
PC5: SB181.2 U8.45(PC5)
PC6: U8.96(PC6)
PC7: U8.97(PC7)
PC8: U8.98(PC8)
PC9: U8.99(PC9)
PC10: U8.111(PC10)
PC11: U8.112(PC11)
PC12: U8.113(PC12)
PC13: SB173.1 U8.7(PC13)
PC14: R37.2 U8.8(PC14-OSC32_IN)
PC15: R38.2 U8.9(PC15-OSC32_OUT)
PD0: U8.114(PD0)
PD1: U8.115(PD1)
PD2: U8.116(PD2)
PD3: U8.117(PD3)
PD4: U8.118(PD4)
PD5: U8.119(PD5)
PD6: U8.122(PD6)
PD7: U8.123(PD7)
PD8: SB5.2 U8.77(PD8)
PD9: SB6.2 U8.78(PD9)
PD10: U8.79(PD10)
PD11: U8.80(PD11)
PD12: U8.81(PD12)
PD13: U8.82(PD13)
PD14: U8.85(PD14)
PD15: U8.86(PD15)
PE0: U8.141(PE0)
PE1: U8.142(PE1)
PE2: U8.1(PE2)
PE3: U8.2(PE3)
PE4: U8.3(PE4)
PE5: U8.4(PE5)
PE6: U8.5(PE6)
PE7: U8.58(PE7)
PE8: U8.59(PE8)
PE9: U8.60(PE9)
PE10: U8.63(PE10)
PE11: U8.64(PE11)
PE12: U8.65(PE12)
PE13: U8.66(PE13)
PE14: U8.67(PE14)
PE15: U8.68(PE15)
PF0: U8.10(PF0/PH0)
PF1: U8.11(PF1/PH1)
PF2: U8.12(PF2)
PF3: U8.13(PF3)
PF4: U8.14(PF4)
PF5: U8.15(PF5)
PF6: U8.18(PF6)
PF7: U8.19(PF7)
PF8: U8.20(PF8)
PF9: U8.21(PF9)
PF10: U8.22(PF10)
PF11: U8.49(PF11)
PF12: U8.50(PF12)
PF13: U8.53(PF13)
PF14: U8.54(PF14)
PF15: U8.55(PF15)
PG0: U8.56(PG0)
PG1: U8.57(PG1)
PG2: U8.87(PG2)
PG3: U8.88(PG3)
PG4: U8.89(PG4)
PG5: U8.90(PG5)
PG6: U8.91(PG6) ; port USB_GPIO_OUT
PG7: JP4.2(NO) U8.92(PG7)
PG8: U8.93(PG8)
PG9: U8.124(PG9)
PG10: U8.125(PG10)
PG11: SB183.1 U8.126(PG11)
PG12: U8.127(PG12)
PG13: SB182.1 U8.128(PG13)
PG14: U8.129(PG14)
PG15: U8.132(PG15)
PH0: SB8.2 SB149.2 U8.23(PH0/PF0-OSC_IN)
PH1: SB9.2 U8.24(PH1/PF1-OSC_OUT)
PH2: SB123.2
Usr_But: R59.2 SB173.2 SB180.1
NetB1_1: B1.1(A0) B1.4(A1) C52.2 R58.1 R59.1
NetC35_1: C35.1 R37.1 X2.2
NetC36_1: C36.1 R38.1 X2.1
NetC37_1: C37.1 SB8.1 X3.2(OSC2)
NetC38_1: C38.1 SB9.1 X3.1(OSC1)
NetC52_1: C52.1 R60.2
NetC54_1: R35.1 ; port USB_VBUS
NetC55_1: C55.1 SB123.1 SB124.1 U8.106(VCAP2/PH2/VDDUSB)
NetC56_1: C56.1 SB129.1 U8.71(VCAP1/VSS_1)
NetCN5_1: SB5.1 ; port STLK_RX
NetCN5_2: SB6.1 ; port STLK_TX
NetCN9_15: JP6.2(NO) ; port RMII_CRS_DV, port COMP2_INP
NetCN13_2: SB133.1 ; port USB_DM
NetCN13_3: SB132.1 ; port USB_DP
NetCN13_4: SB125.1 ; port USB_ID
NetJP4_1: JP4.1(COMMON) ; port USB_GPIO_IN
NetJP7_1: JP7.1(COMMON) ; port RMII_TXD1
NetL1_2: L1.2 SB12.1
NetLD2_1: LD2.1(A) R31.2
NetLD3_1: LD3.1(A) R30.2
NetR30_1: R30.1 SB118.2
NetR31_1: R31.1 SB139.2
NetR35_2: R35.2 SB127.1
NetR42_2: SB178.1 ; port RMII_RXD0
NetR45_2: SB181.1 ; port RMII_RXD1
NetR46_1: SB160.1 ; port RMII_MDIO
NetR48_2: SB13.1 ; port RMII_REF_CLK
NetR73_2: R73.2 SB142.1 SB152.1
NetSB153_1: SB153.1 SB154.1 U8.143(PDR_ON/VSS_3/NC)
NetSB155_1: SB155.1 U8.38(VSS_4/BYPASS_REG)
NetSB161_2: SB161.2 SB166.2 U8.30(VDD_12/VSSA)
NetSB164_1: SB164.1 ; port RMII_MDC
NetSB182_2: SB182.2 ; port RMII_TXD0
NetSB183_2: SB183.2 ; port RMII_TX_EN

### Buses and harness runs
bus PA[0..15] = port PA[0..15]
bus PB[0..15] = port PB[0..15]
bus PC[0..15] = port PC[0..15]
bus PD[0..15] = port PD[0..15]
bus PE[0..15] = port PE[0..15]
bus PF[0..15] = port PF[0..15]
bus PG[0..15] = port PG[0..15]
bus PH[0..2] = port PH[0..2]

### Notes on the sheet
- R73 only fitted on F2 & F4 Series
- (near R73) BOOT1
- /PH0
- /PH1
- (near R35) R35,SB125 & SB127 removed only for F303ZE
- USART3_TX
- USART3_RX
- (near C35) C35 & C36: 1.5pF for F303ZE
- /PF0
- /PF1
- (near SB123) L476ZG:VDDUSB & F303ZE:PH2
- L476ZG/F303ZE:VSS
- L476ZG/F303ZE:VSS & F207ZG:NC
- F407ZG:BYPASS_REG
- (near SB155) Ceramic capacitor (Low ESR)
- L476ZG/F303ZE:VSSA
- Title:
- Project:
- Size:
- Date:
- A3
- Reference:
- Sheet:
- Revision:
- of

### Library data of the parts
B1 B2 = SW PUSHBUTTON: SE PUSHBUTTON
C21 = CAP SMD 0603  X5R 1µF 25V 10%: 0603  X5R 4.7uF; Value: 1µF; Rated voltage: 25V; Tolerance: 10%; Manufacturer: *; Manufacturer P/N: *; Order code Farnell: 1288202RL; Power: *; Technology: X5R; Temperature  Factor: *; Temperature Max: +125°C; Temperature Min: -55°C; STS Code: *
C24-C34 C39 C58 = Cap: Capacitor; Value: 10nF; Published: 8-Jun-2000; Revision: July-2002: Re-released for DXP Platform.; Publisher: Altium Limited
C35-C38 = CAP: Capacitor
C52 C53 = CAP: Capacitor; Value: 100pF; Published: 8-Jun-2000; Revision: July-2002: Re-released for DXP Platform.; Publisher: Altium Limited
C55 C56 = Cap_2.2uF_X7R_10%_0805: Capacitor,2.2uF,16V, X7R,10%,0805,YAGEO; Manuf_Part_1: CC0805KKX7R7BB225; Revision: July-2002: Re-released for DXP Platform.; Value: 2.2uF; Order: CC0805KKX7R7BB225; Manuf_1: YAGEO
C57 = CAP SMD 0603  X5R 1µF 25V 10%: as C20 on sheet MB1137; Manufacturer: *; Manufacturer P/N: *; Order code Farnell: 1288202RL; Value: 1µF; Power: *; Technology: X5R; Temperature  Factor: *; Temperature Max: +125°C; Temperature Min: -55°C; STS Code: *
JP4 JP6 JP7 = JP2
L1 = Inductor: Value: 100uH; Published: 8-Jun-2000; Revision: July-2002: Re-released for DXP Platform.; Publisher: Altium Limited
LD2 LD3 = LED2: as LD5 on sheet MB1137; Published: 8-Jun-2000; Revision: July-2002: Re-released for DXP Platform.; Publisher: Altium Limited
R30 = Res1: Resistor; Published: 8-Jun-2000; Revision: July-2002: Re-released for DXP Platform.; Publisher: Altium Limited; Value: 1K
R31 R37 R38 R59 R60 = Res1: Resistor; Value: 1K; Published: 8-Jun-2000; Revision: July-2002: Re-released for DXP Platform.; Publisher: Altium Limited
R35 = Resistor_ST: Resistor 0402 / 0603 / 0805; Value: 10K
R36 R58 R73 = res1: Resistor; Value: 1K; Published: 8-Jun-2000; Revision: July-2002: Re-released for DXP Platform.; Publisher: Altium Limited
SB5 SB6 SB12 SB13 SB118 SB132 SB133 SB139 SB149 SB155 SB156 SB160 SB162 SB164 SB173 SB178 SB181-SB183 = Circuit Breaker_close: Circuit Breaker; Published: 24-Mar-1999; Revision: July-2002: Re-released for DXP Platform.; Publisher: Altium Limited
SB8 SB9 SB142 SB152 SB180 = Circuit Breaker: Published: 24-Mar-1999; Revision: July-2002: Re-released for DXP Platform.; Publisher: Altium Limited
SB123-SB125 SB127 SB129 SB153 SB154 SB161 SB166 = Circuit Breaker: Solder: NO; Published: 24-Mar-1999; Revision: July-2002: Re-released for DXP Platform.; Publisher: Altium Limited
TP1 = TP
X2 = CRYSTAL_32K: Crystal
X3 = XTAL: Crystal Oscillator; Published: 8-Jun-2000; LatestRevisionDate: 17-Jul-2002; LatestRevisionNote: Re-released for DXP Platform.; PackageReference: R38; Publisher: Altium Limited

## Sheet USB.SchDoc: USB
size A4; DocumentNumber: MB1137; Revision: B-01; SheetNumber: 4; SheetTotal: 6; Project: NUCLEO-XXXXZX
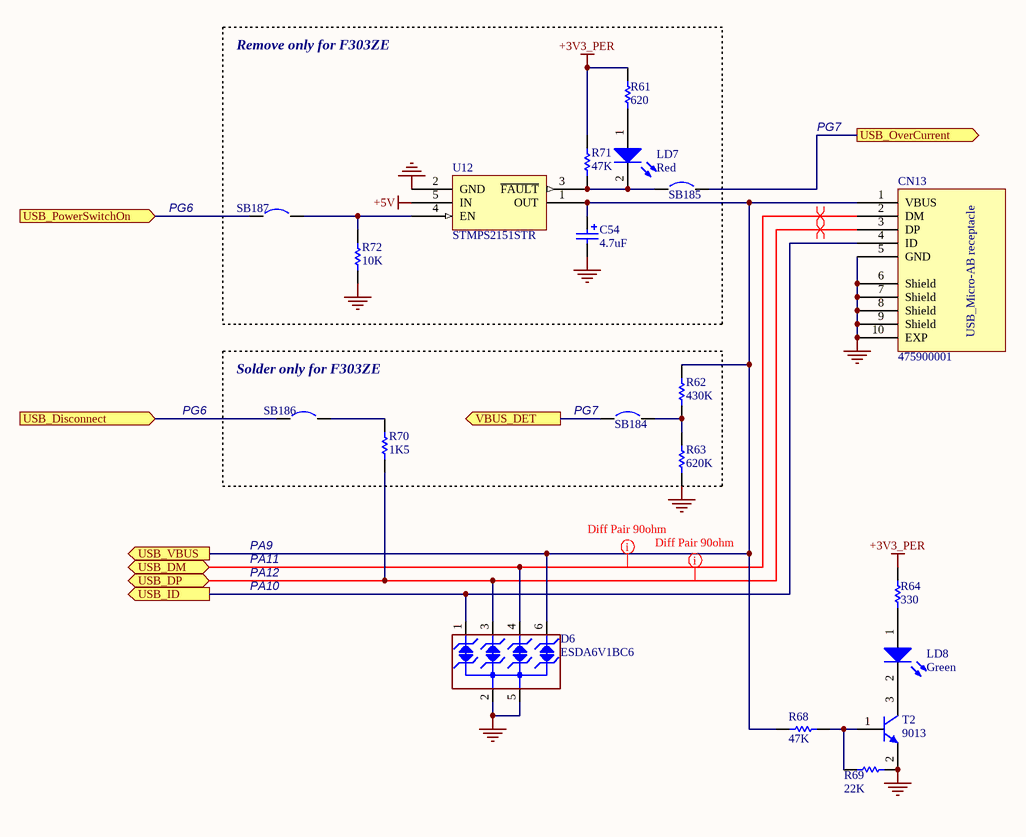
[diagram p5: USB.SchDoc]

### Parts
C54  4.7uF  [TAN-A]
CN13  475900001  [MOLEX_47590001]
D6  ESDA6V1BC6  [SOT23-6L]
LD7  Red  [0603D-R]
LD8  Green  [0603D-G]
R61  620  [0603R]
R62  430K  [0603R]
R63  620K  [0603R]
R64  330  [0603R]
R68  47K  [0603R]
R69  22K  [0603R]
R70  1K5  [0603R]
R71  47K  [0603R]
R72  10K  [0603R]
SB184  Circuit Breaker  [SB_0603]  (value not drawn)
SB185  Circuit Breaker  [SB_0603]  (value not drawn)
SB186  Circuit Breaker  [SB_0603]  (value not drawn)
SB187  Circuit Breaker  [SB_0603]  (value not drawn)
T2  9013  [SOT-23]
U12  STMPS2151STR  [SOT-23-5L]

### Blocks framed on the sheet
Remove only for F303ZE: C54 LD7 R61 R71 R72 SB185 SB187 U12
Solder only for F303ZE: R62 R63 R70 SB184 SB186

### Ports
USB_Disconnect (in), USB_DM (bidir), USB_DP (bidir), USB_ID (out), USB_OverCurrent (out), USB_PowerSwitchOn (in), USB_VBUS (out), VBUS_DET (out)

### Nets
+3V3_PER: R61.2 R64.2 R71.1
+5V: U12.5(IN)
GND: C54.2 CN13.5(GND) CN13.6(Shield) CN13.7(Shield) CN13.8(Shield) CN13.9(Shield) CN13.10(EXP) D6.2(IO2) D6.5(IO4) R63.2 R69.1 R72.1 T2.2(E) U12.2(GND)
PG6: SB186.1 SB187.1 ; port USB_PowerSwitchOn, port USB_Disconnect
NetC54_1: C54.1 CN13.1(VBUS) D6.6(NC) R62.1 R68.1 U12.1(OUT) ; port USB_VBUS
NetCN13_2: CN13.2(DM) D6.4(IO3) ; port USB_DM
NetCN13_3: CN13.3(DP) D6.3(GND) R70.1 ; port USB_DP
NetCN13_4: CN13.4(ID) D6.1(IO1) ; port USB_ID
NetJP4_1: SB184.1 SB185.2 ; port USB_OverCurrent, port VBUS_DET
NetLD7_1: LD7.1(A) R61.1
NetLD7_2: LD7.2(K) R71.2 SB185.1 U12.3(~{FAULT})
NetLD8_1: LD8.1(A) R64.1
NetLD8_2: LD8.2(K) T2.3(C)
NetR62_2: R62.2 R63.1 SB184.2
NetR68_2: R68.2 R69.2 T2.1(B)
NetR70_2: R70.2 SB186.2
NetR72_2: R72.2 SB187.2 U12.4(EN)

### Layout directives
mark named Diff Pair 90ohm: NetCN13_2, NetCN13_3
differential pair: NetCN13_2, NetCN13_3

### Notes on the sheet
- PG7
- PG6
- (near SB184) PG7
- PA9
- PA12
- PA11
- PA10
- Title:
- Project:
- Size:
- Date:
- A4
- Reference:
- Sheet:
- Revision:
- of
- (in symbol 475900001) USB_Micro-AB receptacle

### Library data of the parts
C54 = Cap Pol1: Polarized Capacitor (Radial); Value: 47uF; Published: 8-Jun-2000; Revision: July-2002: Re-released for DXP Platform.; Publisher: Altium Limited
D6 = ESDA6V1BC6: 4-line ESD protection; Manuf_1: STM; Manuf_Part_1: ESDA5V3L; Ref St: 9179034; Provided: ST; ECCN_US/EU: EAR99/NEC; Distrib: ST; Order: ESDA5V3L; Ordered by: STM
LD7 LD8 = LED2: as LD5 on sheet MB1137; Published: 8-Jun-2000; Revision: July-2002: Re-released for DXP Platform.; Publisher: Altium Limited
R61 R72 = Res1: Resistor; Value: 1K; Published: 8-Jun-2000; Revision: July-2002: Re-released for DXP Platform.; Publisher: Altium Limited
R62-R64 R68 R69 R71 = res1: Resistor; Value: 1K; Published: 8-Jun-2000; Revision: July-2002: Re-released for DXP Platform.; Publisher: Altium Limited
R70 = Resistor_ST: Resistor 0402 / 0603 / 0805; Value: 10K
SB184-SB187 = Circuit Breaker: Solder: NO; Published: 24-Mar-1999; Revision: July-2002: Re-released for DXP Platform.; Publisher: Altium Limited
T2 = NPN: as T1 on sheet ST_LINK_V2-1; Published: 8-Jun-2000; Revision: July-2002: Re-released for DXP Platform.; Publisher: Altium Limited
U12 = STMPS2141STR